# EAGLE schematic J007017_RGB_IR (EAGLE 7.7.0), part 1 of 2

## Sheet 1 of 6
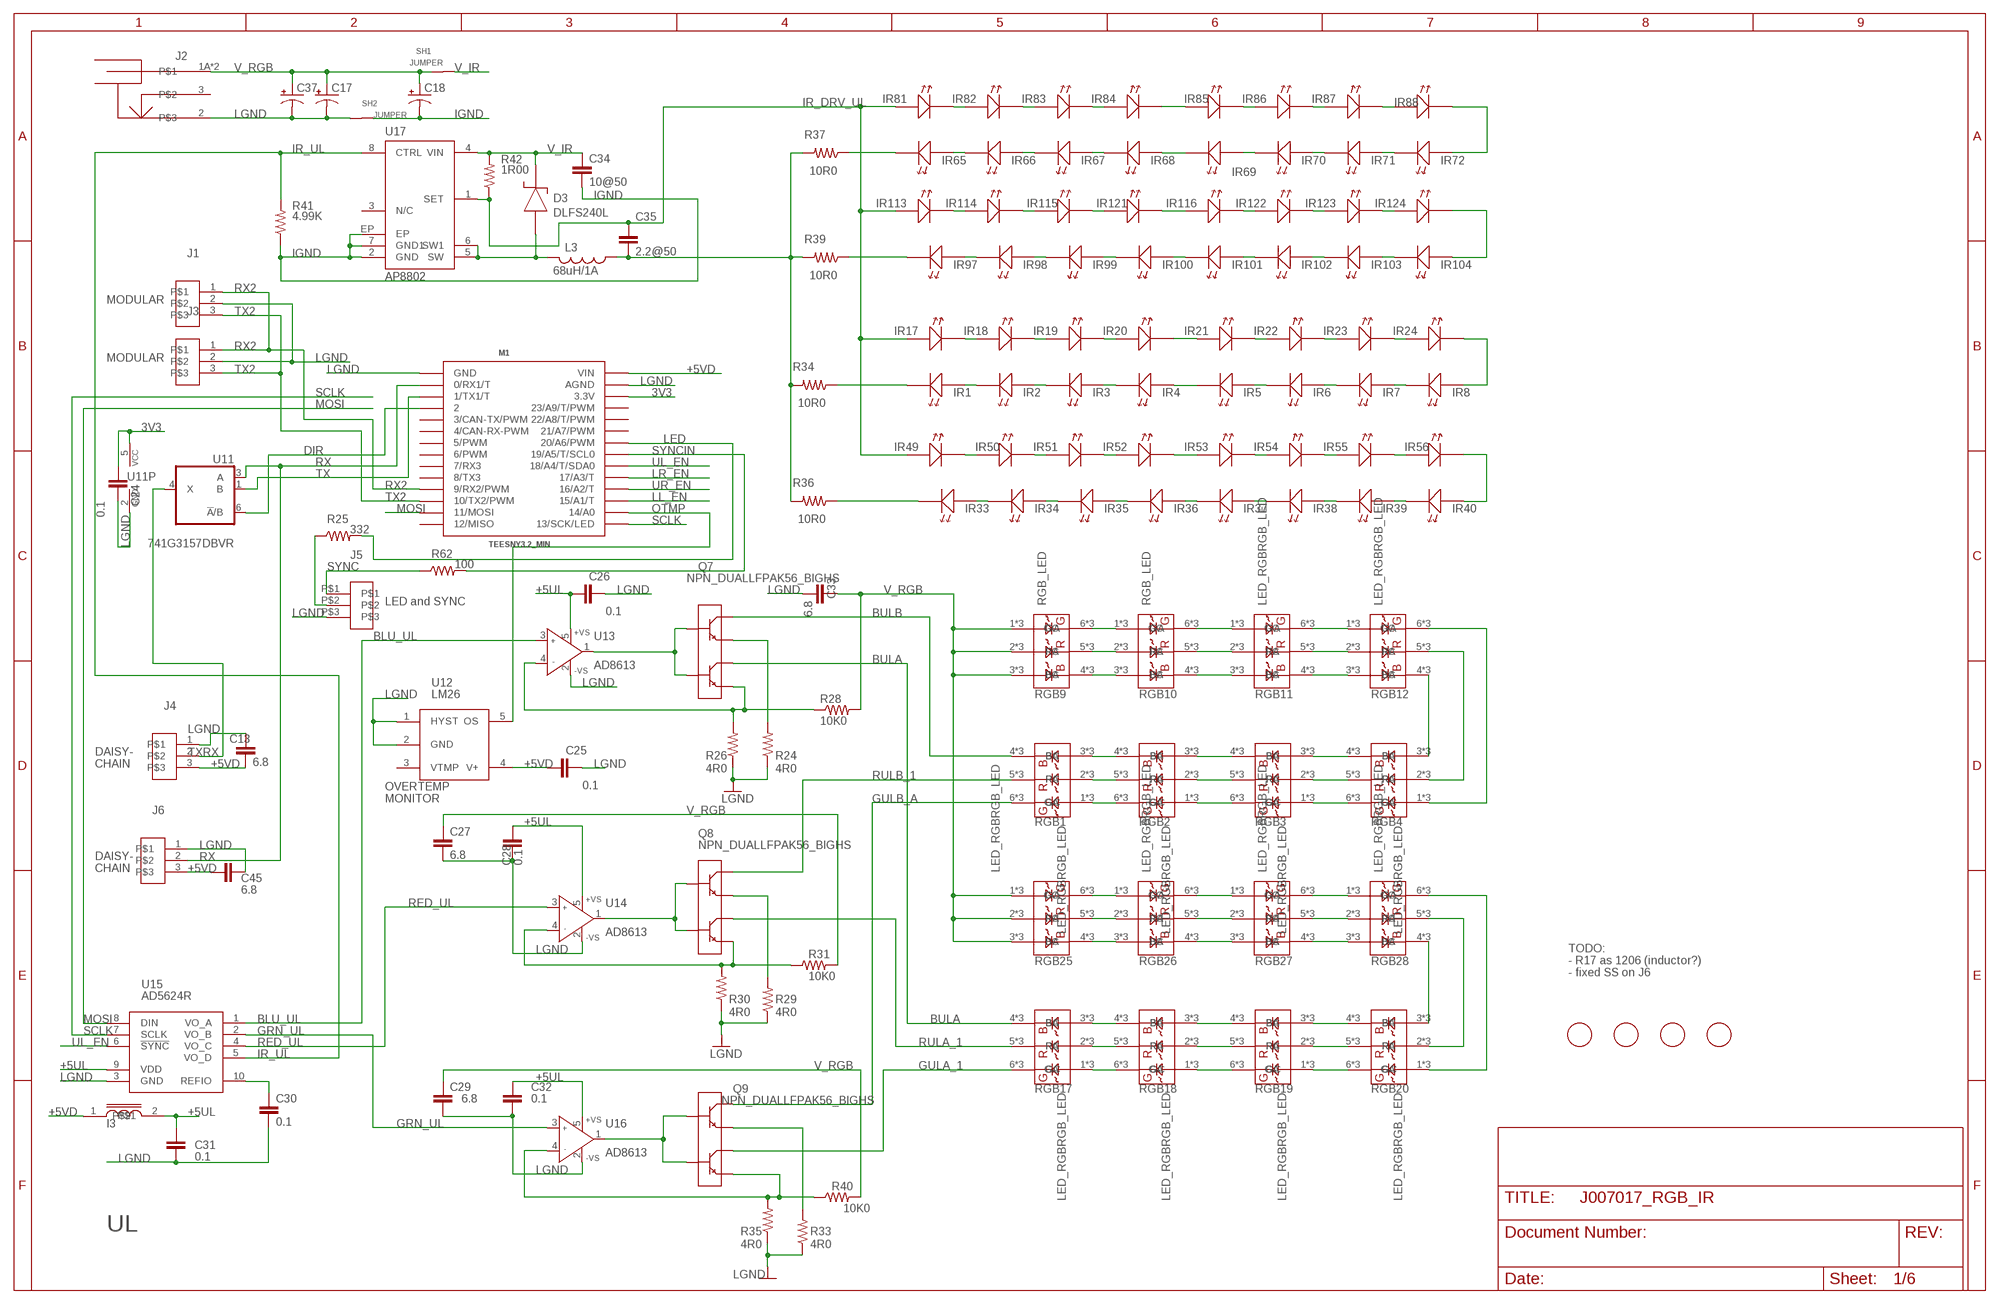
[diagram p0: schematic, sheet 1]

### Parts
$$U$1  FIDUCIAL  [FIDUCIAL_1MM]
$$U$2  FIDUCIAL  [FIDUCIAL_1MM]
$$U$3  FIDUCIAL  [FIDUCIAL_1MM]
C13  6.8  CAPS1210S  [1210S]
C17  CPOL-US153CLV-0810  [153CLV-0810]
C18  CPOL-US153CLV-0810  [153CLV-0810]
C24  0.1  CAPS0603S  [0603S]
C25  0.1  CAPS0603S  [0603S]
C26  0.1  CAPS0603S  [0603S]
C27  6.8  CAPS1210S  [1210S]
C28  0.1  CAPS0603S  [0603S]
C29  6.8  CAPS1210S  [1210S]
C30  0.1  CAPS0603S  [0603S]
C31  0.1  CAPS0603S  [0603S]
C32  0.1  CAPS0603S  [0603S]
C33  6.8  CAPS1210S  [1210S]
C34  10@50  CAPS1210S  [1210S]
C35  2.2@50  CAPS1206S  [1206S]
C37  CPOL-US153CLV-0810  [153CLV-0810]
C45  6.8  CAPS1210S  [1210S]
D3  DLFS240L  DIODE_SCHOTTKYPWRDI-123  [PWRDI-123]
I3  INDUCTOR0805S  [0805S]
IR1  LEDLED_SFH4050_A  [LED_SFH4045_HEAT_A]
IR2  LEDLED_SFH4050_HEAT  [LED_SFH4050_HEAT]
IR3  LEDLED_SFH4050_HEAT  [LED_SFH4050_HEAT]
IR4  LEDLED_SFH4050_HEAT  [LED_SFH4050_HEAT]
IR5  LEDLED_SFH4050_HEAT  [LED_SFH4050_HEAT]
IR6  LEDLED_SFH4050_HEAT  [LED_SFH4050_HEAT]
IR7  LEDLED_SFH4050_HEAT  [LED_SFH4050_HEAT]
IR8  LEDLED_SFH4050_HEAT  [LED_SFH4050_HEAT]
IR17  LEDLED_SFH4050_HEAT  [LED_SFH4050_HEAT]
IR18  LEDLED_SFH4050_HEAT  [LED_SFH4050_HEAT]
IR19  LEDLED_SFH4050_HEAT  [LED_SFH4050_HEAT]
IR20  LEDLED_SFH4050_HEAT  [LED_SFH4050_HEAT]
IR21  LEDLED_SFH4050_HEAT  [LED_SFH4050_HEAT]
IR22  LEDLED_SFH4050_HEAT  [LED_SFH4050_HEAT]
IR23  LEDLED_SFH4050_HEAT  [LED_SFH4050_HEAT]
IR24  LEDLED_SFH4050_HEAT  [LED_SFH4050_HEAT]
IR33  LEDLED_SFH4050_HEAT  [LED_SFH4050_HEAT]
IR34  LEDLED_SFH4050_HEAT  [LED_SFH4050_HEAT]
IR35  LEDLED_SFH4050_HEAT  [LED_SFH4050_HEAT]
IR36  LEDLED_SFH4050_HEAT  [LED_SFH4050_HEAT]
IR37  LEDLED_SFH4050_HEAT  [LED_SFH4050_HEAT]
IR38  LEDLED_SFH4050_HEAT  [LED_SFH4050_HEAT]
IR39  LEDLED_SFH4050_HEAT  [LED_SFH4050_HEAT]
IR40  LEDLED_SFH4050_HEAT  [LED_SFH4050_HEAT]
IR49  LEDLED_SFH4050_HEAT  [LED_SFH4050_HEAT]
IR50  LEDLED_SFH4050_HEAT  [LED_SFH4050_HEAT]
IR51  LEDLED_SFH4050_HEAT  [LED_SFH4050_HEAT]
IR52  LEDLED_SFH4050_HEAT  [LED_SFH4050_HEAT]
IR53  LEDLED_SFH4050_HEAT  [LED_SFH4050_HEAT]
IR54  LEDLED_SFH4050_HEAT  [LED_SFH4050_HEAT]
IR55  LEDLED_SFH4050_HEAT  [LED_SFH4050_HEAT]
IR56  LEDLED_SFH4050_HEAT  [LED_SFH4050_HEAT]
IR65  LEDLED_SFH4050_HEAT  [LED_SFH4050_HEAT]
IR66  LEDLED_SFH4050_HEAT  [LED_SFH4050_HEAT]
IR67  LEDLED_SFH4050_HEAT  [LED_SFH4050_HEAT]
IR68  LEDLED_SFH4050_HEAT  [LED_SFH4050_HEAT]
IR69  LEDLED_SFH4050_HEAT  [LED_SFH4050_HEAT]
IR70  LEDLED_SFH4050_HEAT  [LED_SFH4050_HEAT]
IR71  LEDLED_SFH4050_HEAT  [LED_SFH4050_HEAT]
IR72  LEDLED_SFH4050_HEAT  [LED_SFH4050_HEAT]
IR81  LEDLED_SFH4050_HEAT  [LED_SFH4050_HEAT]
IR82  LEDLED_SFH4050_HEAT  [LED_SFH4050_HEAT]
IR83  LEDLED_SFH4050_HEAT  [LED_SFH4050_HEAT]
IR84  LEDLED_SFH4050_HEAT  [LED_SFH4050_HEAT]
IR85  LEDLED_SFH4050_HEAT  [LED_SFH4050_HEAT]
IR86  LEDLED_SFH4050_HEAT  [LED_SFH4050_HEAT]
IR87  LEDLED_SFH4050_HEAT  [LED_SFH4050_HEAT]
IR88  LEDLED_SFH4050_HEAT  [LED_SFH4050_HEAT]
IR97  LEDLED_SFH4050_HEAT  [LED_SFH4050_HEAT]
IR98  LEDLED_SFH4050_HEAT  [LED_SFH4050_HEAT]
IR99  LEDLED_SFH4050_HEAT  [LED_SFH4050_HEAT]
IR100  LEDLED_SFH4050_HEAT  [LED_SFH4050_HEAT]
IR101  LEDLED_SFH4050_HEAT  [LED_SFH4050_HEAT]
IR102  LEDLED_SFH4050_HEAT  [LED_SFH4050_HEAT]
IR103  LEDLED_SFH4050_HEAT  [LED_SFH4050_HEAT]
IR104  LEDLED_SFH4050_HEAT  [LED_SFH4050_HEAT]
IR113  LEDLED_SFH4050_HEAT  [LED_SFH4050_HEAT]
IR114  LEDLED_SFH4050_HEAT  [LED_SFH4050_HEAT]
IR115  LEDLED_SFH4050_HEAT  [LED_SFH4050_HEAT]
IR116  LEDLED_SFH4050_HEAT  [LED_SFH4050_HEAT]
IR121  LEDLED_SFH4050_HEAT  [LED_SFH4050_HEAT]
IR122  LEDLED_SFH4050_HEAT  [LED_SFH4050_HEAT]
IR123  LEDLED_SFH4050_HEAT  [LED_SFH4050_HEAT]
IR124  LEDLED_SFH4050  [LED_SFH4050]
J1  CON3AMP-3-SM-RA-X  [AMP-3-SM-RA-X]
J2  POWER_JACK_SHUNTPJ-002  [PJ-002]
J3  CON3AMP_3_SM  [AMP_3_SM]
J4  CON3TE-3-SM-V  [TE_3_SM-V]
J5  CON3DF13-3-V-SM  [DF13_3_V_SM]
J6  CON3TE-3-SM-V  [TE_3_SM-V]
L3  68uH/1A  INDUCTOR_SMSRU8043  [SRU8043]
M1  TEESNY3.2_MIN  [TEENSY3.2_MIN_SM]
Q7  NPN_DUALLFPAK56_BIGHS  [LFPAK56_HS2]
Q8  NPN_DUALLFPAK56_BIGHS  [LFPAK56_HS2]
Q9  NPN_DUALLFPAK56_BIGHS  [LFPAK56_HS2]
R24  4R0  RESISTOR-POWER1812  [1812]
R25  332  RESISTOR_SM0805S  [0805S]
R26  4R0  RESISTOR-POWER1812  [1812]
R28  10K0  RESISTOR_SM1206S  [1206S]
R29  4R0  RESISTOR-POWER1812  [1812]
R30  4R0  RESISTOR-POWER1812  [1812]
R31  10K0  RESISTOR_SM1206S  [1206S]
R33  4R0  RESISTOR-POWER1812  [1812]
R34  10R0  RESISTOR_SM1206S  [1206S]
R35  4R0  RESISTOR-POWER1812  [1812]
R36  10R0  RESISTOR_SM1206S  [1206S]
R37  10R0  RESISTOR_SM1206S  [1206S]
R39  10R0  RESISTOR_SM1206S  [1206S]
R40  10K0  RESISTOR_SM1206S  [1206S]
R41  4.99K  RESISTOR_SM0805S  [0805S]
R42  1R00  RESISTOR_SM1206S  [1206S]
R62  100  RESISTOR_SM0805S  [0805S]
RGB1  LED_RGBRGB_LED  [OVSPRGB_HS_FIXED]
RGB2  LED_RGBRGB_LED  [OVSPRGB_HS_FIXED]
RGB3  LED_RGBRGB_LED  [OVSPRGB_HS_FIXED]
RGB4  LED_RGBRGB_LED  [OVSPRGB_HS_FIXED]
RGB9  RGB_LED  LED_RGBRGB_LED  [OVSPRGB_HS_FIXED]
RGB10  RGB_LED  LED_RGBRGB_LED  [OVSPRGB_HS_FIXED]
RGB11  LED_RGBRGB_LED  [OVSPRGB_HS_FIXED]
RGB12  LED_RGBRGB_LED  [OVSPRGB_HS_FIXED]
RGB17  LED_RGBRGB_LED  [OVSPRGB_HS_FIXED]
RGB18  LED_RGBRGB_LED  [OVSPRGB_HS_FIXED]
RGB19  LED_RGBRGB_LED  [OVSPRGB_HS_FIXED]
RGB20  LED_RGBRGB_LED  [OVSPRGB_HS_FIXED]
RGB25  LED_RGBRGB_LED  [OVSPRGB_HS_FIXED]
RGB26  LED_RGBRGB_LED  [OVSPRGB_HS_FIXED]
RGB27  LED_RGBRGB_LED  [OVSPRGB_HS_FIXED]
RGB28  LED_RGBRGB_LED  [OVSPRGB_HS_FIXED]
SH1  JUMPER  [JUMPER]
SH2  JUMPER  [JUMPER]
U11  741G3157DBVR  [DBV_R-PDSO-G6]
U12  LM26  [SOT23-5]
U13  AD8613  AD8065RT  [SOT23-5]
U14  AD8613  AD8065RT  [SOT23-5]
U15  AD5624R  AD56X4R  [MSOP10]
U16  AD8613  AD8065RT  [SOT23-5]
U17  AP8802  [SOIC8-EP]
U$2  FIDUCIAL  [FIDUCIAL_1MM]

### Nets
3V3: C24.1 M1.26(3.3V) U11.5(VCC)
+5UL: C26.1 C28.1 C31.1 C32.1 I3.2 U13.5(+VS) U14.5(+VS) U15.9(VDD) U16.5(+VS)
+5VD: C13.2 C25.1 C45.1 I3.1 J4.3 J6.3 M1.28(VIN) U12.4(V+) ; also sheet 3,4,6
BLU_UL: U13.3(IN+) U15.1(VO_A)
BULA: Q7.5(C2) Q7.5A1(C2) Q7.5A(C2) Q7.5B(C2) Q7.5C1(C2) Q7.5C2(C2) Q7.5C(C2) Q7.6(C2) Q7.56(C2) Q7.56A(C2) Q7.56B(C2) RGB17.4(BC) RGB17.4A(BC) RGB17.4B(BC)
BULB: Q7.7(C1) Q7.8(C1) Q7.8A(C1) Q7.8B(C1) Q7.8C1(C1) Q7.8C2(C1) Q7.8C3(C1) Q7.8C(C1) Q7.78(C1) Q7.78A(C1) Q7.78B(C1) RGB1.4(BC) RGB1.4A(BC) RGB1.4B(BC)
DIR: M1.4 U11.6(!A!/B)
GRN_UL: U15.2(VO_B) U16.3(IN+)
GULA_1: Q9.5(C2) Q9.5A1(C2) Q9.5A(C2) Q9.5B(C2) Q9.5C1(C2) Q9.5C2(C2) Q9.5C(C2) Q9.6(C2) Q9.56(C2) Q9.56A(C2) Q9.56B(C2) RGB17.6(GC) RGB17.6A(GC) RGB17.6B(GC)
GULB_A: Q9.7(C1) Q9.8(C1) Q9.8A(C1) Q9.8B(C1) Q9.8C1(C1) Q9.8C2(C1) Q9.8C3(C1) Q9.8C(C1) Q9.78(C1) Q9.78A(C1) Q9.78B(C1) RGB1.6(GC) RGB1.6A(GC) RGB1.6B(GC)
IGND: C18.- C34.2 R41.1 SH2.2 U17.2(GND) U17.7(GND1) U17.EP ; also sheet 3,4,6
IR_DRV_UL: C35.1 IR17.A IR17.A1(A) IR49.A IR49.A1(A) IR81.A IR81.A1(A) IR113.A IR113.A1(A) R42.1 U17.1(SET)
IR_RET_UL: C35.2 L3.1 R34.2 R36.2 R37.2 R39.2
IR_UL: R41.2 U15.5(VO_D) U17.8(CTRL)
LED: M1.22(20/A6/PWM) R25.2
LGND: C13.1 C17.- C24.2 C25.2 C26.2 C27.2 C28.2 C29.2 C30.2 C31.2 C32.2 C33.2 C37.- C45.2 J1.2 J2.2 J3.2 J4.1 J5.P$3 J6.1 M1.1(GND) M1.27(AGND) R24.1 R26.1 R29.1 R30.1 R33.1 R35.1 SH2.1 U11.2(GND) U12.1(HYST) U12.2(GND) U13.2(-VS) U14.2(-VS) U15.3(GND) U16.2(-VS) ; also sheet 3,4,6
LL_EN: M1.17(15/A1/T) ; also sheet 3
LR_EN: M1.19(17/A3/T) ; also sheet 6
MOSI: M1.13(11/MOSI) U15.8(DIN) ; also sheet 3,4,6
N$1: IR7.A IR7.A1(A) IR8.C1(K) IR8.C(K)
N$2: IR6.A IR6.A1(A) IR7.C1(K) IR7.C(K)
N$3: IR71.A IR71.A1(A) IR72.C1(K) IR72.C(K)
N$4: IR70.A IR70.A1(A) IR71.C1(K) IR71.C(K)
N$5: IR69.A IR69.A1(A) IR70.C1(K) IR70.C(K)
N$6: IR67.A IR67.A1(A) IR68.C1(K) IR68.C(K)
N$7: IR66.A IR66.A1(A) IR67.C1(K) IR67.C(K)
N$8: IR65.A IR65.A1(A) IR66.C1(K) IR66.C(K)
N$9: IR5.A IR5.A1(A) IR6.C1(K) IR6.C(K)
N$10: IR3.A IR3.A1(A) IR4.C1(K) IR4.C(K)
N$11: IR2.A IR2.A1(A) IR3.C1(K) IR3.C(K)
N$12: IR1.A IR1.A1(A) IR2.C1(K) IR2.C(K)
N$13: IR17.C1(K) IR17.C(K) IR18.A IR18.A1(A)
N$14: IR81.C1(K) IR81.C(K) IR82.A IR82.A1(A)
N$15: IR18.C1(K) IR18.C(K) IR19.A IR19.A1(A)
N$16: IR82.C1(K) IR82.C(K) IR83.A IR83.A1(A)
N$17: IR83.C1(K) IR83.C(K) IR84.A IR84.A1(A)
N$18: IR68.A IR68.A1(A) IR69.C1(K) IR69.C(K)
N$19: IR103.A IR103.A1(A) IR104.C1(K) IR104.C(K)
N$20: IR102.A IR102.A1(A) IR103.C1(K) IR103.C(K)
N$21: IR101.A IR101.A1(A) IR102.C1(K) IR102.C(K)
N$22: IR100.A IR100.A1(A) IR101.C1(K) IR101.C(K)
N$23: IR99.A IR99.A1(A) IR100.C1(K) IR100.C(K)
N$24: IR19.C1(K) IR19.C(K) IR20.A IR20.A1(A)
N$25: IR4.A IR4.A1(A) IR5.C1(K) IR5.C(K)
N$26: IR39.A IR39.A1(A) IR40.C1(K) IR40.C(K)
N$27: IR38.A IR38.A1(A) IR39.C1(K) IR39.C(K)
N$28: IR37.A IR37.A1(A) IR38.C1(K) IR38.C(K)
N$29: IR98.A IR98.A1(A) IR99.C1(K) IR99.C(K)
N$30: IR36.A IR36.A1(A) IR37.C1(K) IR37.C(K)
N$31: IR35.A IR35.A1(A) IR36.C1(K) IR36.C(K)
N$32: IR97.A IR97.A1(A) IR98.C1(K) IR98.C(K)
N$33: IR85.C1(K) IR85.C(K) IR86.A IR86.A1(A)
N$34: IR86.C1(K) IR86.C(K) IR87.A IR87.A1(A)
N$35: IR34.A IR34.A1(A) IR35.C1(K) IR35.C(K)
N$36: IR87.C1(K) IR87.C(K) IR88.A IR88.A1(A)
N$37: IR33.A IR33.A1(A) IR34.C1(K) IR34.C(K)
N$38: IR21.C1(K) IR21.C(K) IR22.A IR22.A1(A)
N$39: IR22.C1(K) IR22.C(K) IR23.A IR23.A1(A)
N$40: IR23.C1(K) IR23.C(K) IR24.A IR24.A1(A)
N$41: IR49.C1(K) IR49.C(K) IR50.A IR50.A1(A)
N$42: IR50.C1(K) IR50.C(K) IR51.A IR51.A1(A)
N$43: IR51.C1(K) IR51.C(K) IR52.A IR52.A1(A)
N$44: IR53.C1(K) IR53.C(K) IR54.A IR54.A1(A)
N$45: IR54.C1(K) IR54.C(K) IR55.A IR55.A1(A)
N$46: IR55.C1(K) IR55.C(K) IR56.A IR56.A1(A)
N$47: IR113.C1(K) IR113.C(K) IR114.A IR114.A1(A)
N$48: IR20.C1(K) IR20.C(K) IR21.A IR21.A1(A)
N$49: IR114.C1(K) IR114.C(K) IR115.A IR115.A1(A)
N$50: IR8.A IR8.A1(A) IR24.C1(K) IR24.C(K)
N$51: IR52.C1(K) IR52.C(K) IR53.A IR53.A1(A)
N$52: IR115.C1(K) IR115.C(K) IR121.A IR121.A1(A)
N$53: IR1.C(K) R34.1
N$54: IR40.A IR40.A1(A) IR56.C1(K) IR56.C(K)
N$55: IR33.C1(K) IR33.C(K) R36.1
N$56: RGB9.6(GC) RGB9.6A(GC) RGB9.6B(GC) RGB10.1(GA) RGB10.1A(GA) RGB10.1B(GA)
N$57: RGB9.5(RC) RGB9.5A(RC) RGB9.5B(RC) RGB10.2(RA) RGB10.2A(RA) RGB10.2B(RA)
N$58: IR65.C1(K) IR65.C(K) R37.1
N$60: RGB9.4(BC) RGB9.4A(BC) RGB9.4B(BC) RGB10.3(BA) RGB10.3A(BA) RGB10.3B(BA)
N$61: IR116.C1(K) IR116.C(K) IR122.A IR122.A1(A)
N$63: RGB10.6(GC) RGB10.6A(GC) RGB10.6B(GC) RGB11.1(GA) RGB11.1A(GA) RGB11.1B(GA)
N$64: IR122.C1(K) IR122.C(K) IR123.A IR123.A1(A)
N$65: IR123.C1(K) IR123.C(K) IR124.A
N$66: Q8.3(E2) R30.2 R31.1 U14.4(IN-)
N$67: D3.A L3.2 U17.5(SW) U17.6(SW1)
N$68: IR84.C1(K) IR84.C(K) IR85.A IR85.A1(A)
N$69: RGB10.5(RC) RGB10.5A(RC) RGB10.5B(RC) RGB11.2(RA) RGB11.2A(RA) RGB11.2B(RA)
N$70: IR72.A IR72.A1(A) IR88.C1(K) IR88.C(K)
N$71: C30.1 U15.10(REFIO)
N$72: IR116.A IR116.A1(A) IR121.C1(K) IR121.C(K)
N$73: RGB10.4(BC) RGB10.4A(BC) RGB10.4B(BC) RGB11.3(BA) RGB11.3A(BA) RGB11.3B(BA)
N$74: RGB11.6(GC) RGB11.6A(GC) RGB11.6B(GC) RGB12.1(GA) RGB12.1A(GA) RGB12.1B(GA)
N$75: IR104.A IR104.A1(A) IR124.C(K)
N$77: RGB11.5(RC) RGB11.5A(RC) RGB11.5B(RC) RGB12.2(RA) RGB12.2A(RA) RGB12.2B(RA)
N$78: IR97.C1(K) IR97.C(K) R39.1
N$79: Q9.3(E2) R35.2 R40.1 U16.4(IN-)
N$80: RGB11.4(BC) RGB11.4A(BC) RGB11.4B(BC) RGB12.3(BA) RGB12.3A(BA) RGB12.3B(BA)
N$81: RGB4.1(GA) RGB4.1A(GA) RGB4.1B(GA) RGB12.6(GC) RGB12.6A(GC) RGB12.6B(GC)
N$82: Q8.1(E1) R29.2
N$83: RGB4.2(RA) RGB4.2A(RA) RGB4.2B(RA) RGB12.5(RC) RGB12.5A(RC) RGB12.5B(RC)
N$84: Q8.2(B1) Q8.4(B2) U14.1(OUT)
N$85: RGB4.3(BA) RGB4.3A(BA) RGB4.3B(BA) RGB12.4(BC) RGB12.4A(BC) RGB12.4B(BC)
N$86: RGB3.1(GA) RGB3.1A(GA) RGB3.1B(GA) RGB4.6(GC) RGB4.6A(GC) RGB4.6B(GC)
N$87: RGB3.2(RA) RGB3.2A(RA) RGB3.2B(RA) RGB4.5(RC) RGB4.5A(RC) RGB4.5B(RC)
N$88: RGB3.3(BA) RGB3.3A(BA) RGB3.3B(BA) RGB4.4(BC) RGB4.4A(BC) RGB4.4B(BC)
N$89: RGB2.1(GA) RGB2.1A(GA) RGB2.1B(GA) RGB3.6(GC) RGB3.6A(GC) RGB3.6B(GC)
N$91: RGB2.2(RA) RGB2.2A(RA) RGB2.2B(RA) RGB3.5(RC) RGB3.5A(RC) RGB3.5B(RC)
N$92: RGB2.3(BA) RGB2.3A(BA) RGB2.3B(BA) RGB3.4(BC) RGB3.4A(BC) RGB3.4B(BC)
N$93: RGB1.1(GA) RGB1.1A(GA) RGB1.1B(GA) RGB2.6(GC) RGB2.6A(GC) RGB2.6B(GC)
N$94: RGB1.2(RA) RGB1.2A(RA) RGB1.2B(RA) RGB2.5(RC) RGB2.5A(RC) RGB2.5B(RC)
N$95: RGB1.3(BA) RGB1.3A(BA) RGB1.3B(BA) RGB2.4(BC) RGB2.4A(BC) RGB2.4B(BC)
N$97: Q9.2(B1) Q9.4(B2) U16.1(OUT)
N$99: RGB25.6(GC) RGB25.6A(GC) RGB25.6B(GC) RGB26.1(GA) RGB26.1A(GA) RGB26.1B(GA)
N$100: RGB25.5(RC) RGB25.5A(RC) RGB25.5B(RC) RGB26.2(RA) RGB26.2A(RA) RGB26.2B(RA)
N$101: RGB25.4(BC) RGB25.4A(BC) RGB25.4B(BC) RGB26.3(BA) RGB26.3A(BA) RGB26.3B(BA)
N$102: RGB26.6(GC) RGB26.6A(GC) RGB26.6B(GC) RGB27.1(GA) RGB27.1A(GA) RGB27.1B(GA)
N$103: RGB26.5(RC) RGB26.5A(RC) RGB26.5B(RC) RGB27.2(RA) RGB27.2A(RA) RGB27.2B(RA)
N$104: RGB26.4(BC) RGB26.4A(BC) RGB26.4B(BC) RGB27.3(BA) RGB27.3A(BA) RGB27.3B(BA)
N$105: RGB27.6(GC) RGB27.6A(GC) RGB27.6B(GC) RGB28.1(GA) RGB28.1A(GA) RGB28.1B(GA)
N$106: RGB27.5(RC) RGB27.5A(RC) RGB27.5B(RC) RGB28.2(RA) RGB28.2A(RA) RGB28.2B(RA)
N$107: RGB27.4(BC) RGB27.4A(BC) RGB27.4B(BC) RGB28.3(BA) RGB28.3A(BA) RGB28.3B(BA)
N$108: RGB20.1(GA) RGB20.1A(GA) RGB20.1B(GA) RGB28.6(GC) RGB28.6A(GC) RGB28.6B(GC)
N$109: RGB20.2(RA) RGB20.2A(RA) RGB20.2B(RA) RGB28.5(RC) RGB28.5A(RC) RGB28.5B(RC)
N$110: RGB20.3(BA) RGB20.3A(BA) RGB20.3B(BA) RGB28.4(BC) RGB28.4A(BC) RGB28.4B(BC)
N$111: RGB19.1(GA) RGB19.1A(GA) RGB19.1B(GA) RGB20.6(GC) RGB20.6A(GC) RGB20.6B(GC)
N$112: RGB19.2(RA) RGB19.2A(RA) RGB19.2B(RA) RGB20.5(RC) RGB20.5A(RC) RGB20.5B(RC)
N$113: RGB19.3(BA) RGB19.3A(BA) RGB19.3B(BA) RGB20.4(BC) RGB20.4A(BC) RGB20.4B(BC)
N$114: RGB18.1(GA) RGB18.1A(GA) RGB18.1B(GA) RGB19.6(GC) RGB19.6A(GC) RGB19.6B(GC)
N$115: RGB18.2(RA) RGB18.2A(RA) RGB18.2B(RA) RGB19.5(RC) RGB19.5A(RC) RGB19.5B(RC)
N$116: RGB18.3(BA) RGB18.3A(BA) RGB18.3B(BA) RGB19.4(BC) RGB19.4A(BC) RGB19.4B(BC)
N$117: RGB17.1(GA) RGB17.1A(GA) RGB17.1B(GA) RGB18.6(GC) RGB18.6A(GC) RGB18.6B(GC)
N$118: RGB17.2(RA) RGB17.2A(RA) RGB17.2B(RA) RGB18.5(RC) RGB18.5A(RC) RGB18.5B(RC)
N$119: RGB17.3(BA) RGB17.3A(BA) RGB17.3B(BA) RGB18.4(BC) RGB18.4A(BC) RGB18.4B(BC)
N$120: Q7.2(B1) Q7.4(B2) U13.1(OUT)
N$123: Q7.1(E1) R24.2
N$125: Q9.1(E1) R33.2
N$208: Q7.3(E2) R26.2 R28.1 U13.4(IN-)
N$376: J5.P$2 R25.1
OTMP: M1.16(14/A0) U12.5(OS)
RED_UL: U14.3(IN+) U15.4(VO_C)
RULA_1: Q8.5(C2) Q8.5A1(C2) Q8.5A(C2) Q8.5B(C2) Q8.5C1(C2) Q8.5C2(C2) Q8.5C(C2) Q8.6(C2) Q8.56(C2) Q8.56A(C2) Q8.56B(C2) RGB17.5(RC) RGB17.5A(RC) RGB17.5B(RC)
RULB_1: Q8.7(C1) Q8.8(C1) Q8.8A(C1) Q8.8B(C1) Q8.8C1(C1) Q8.8C2(C1) Q8.8C3(C1) Q8.8C(C1) Q8.78(C1) Q8.78A(C1) Q8.78B(C1) RGB1.5(RC) RGB1.5A(RC) RGB1.5B(RC)
RX: J6.2 M1.2(0/RX1/T) U11.3(A)
RX2: J1.1 J3.1 M1.11(9/RX2/PWM)
SCLK: M1.15(13/SCK/LED) U15.7(SCLK) ; also sheet 3,4,6
SYNC: J5.P$1 R62.1
SYNCIN: M1.21(19/A5/T/SCL0) R62.2
TX: M1.3(1/TX1/T) U11.1(B)
TX2: J1.3 J3.3 M1.12(10/TX2/PWM)
TXRX: J4.2 U11.4(X)
UL_EN: M1.20(18/A4/T/SDA0) U15.6(!SYNC)
UR_EN: M1.18(16/A2/T) ; also sheet 4
V_IR: C34.1 D3.K R42.2 SH1.1 U17.4(VIN) ; also sheet 3,4,6
V_RGB: C17.+ C18.+ C27.1 C29.1 C33.1 C37.+ J2.1A J2.1B R28.2 R31.2 R40.2 RGB9.1(GA) RGB9.1A(GA) RGB9.1B(GA) RGB9.2(RA) RGB9.2A(RA) RGB9.2B(RA) RGB9.3(BA) RGB9.3A(BA) RGB9.3B(BA) RGB25.1(GA) RGB25.1A(GA) RGB25.1B(GA) RGB25.2(RA) RGB25.2A(RA) RGB25.2B(RA) RGB25.3(BA) RGB25.3A(BA) RGB25.3B(BA) SH1.2 ; also sheet 3,4,6
Unconnected: J2.3 M1.5(3/CAN-TX/PWM) M1.6(4/CAN-RX-PWM) M1.7(5/PWM) M1.8(6/PWM) M1.9(7/RX3) M1.10(8/TX3) M1.14(12/MISO) M1.23(21/A7/PWM) M1.24(22/A8/T/PWM) M1.25(23/A9/T/PWM) U12.3(VTMP) U17.3(N/C)

### Notes on the sheet
- MODULAR
- MODULAR
- LED and SYNC
- DAISY-
  CHAIN
- OVERTEMP
  MONITOR
- DAISY-
  CHAIN
- TODO:
  - R17 as 1206 (inductor?)
  - fixed SS on J6
- UL

## Sheet 2 of 6

## Sheet 3 of 6
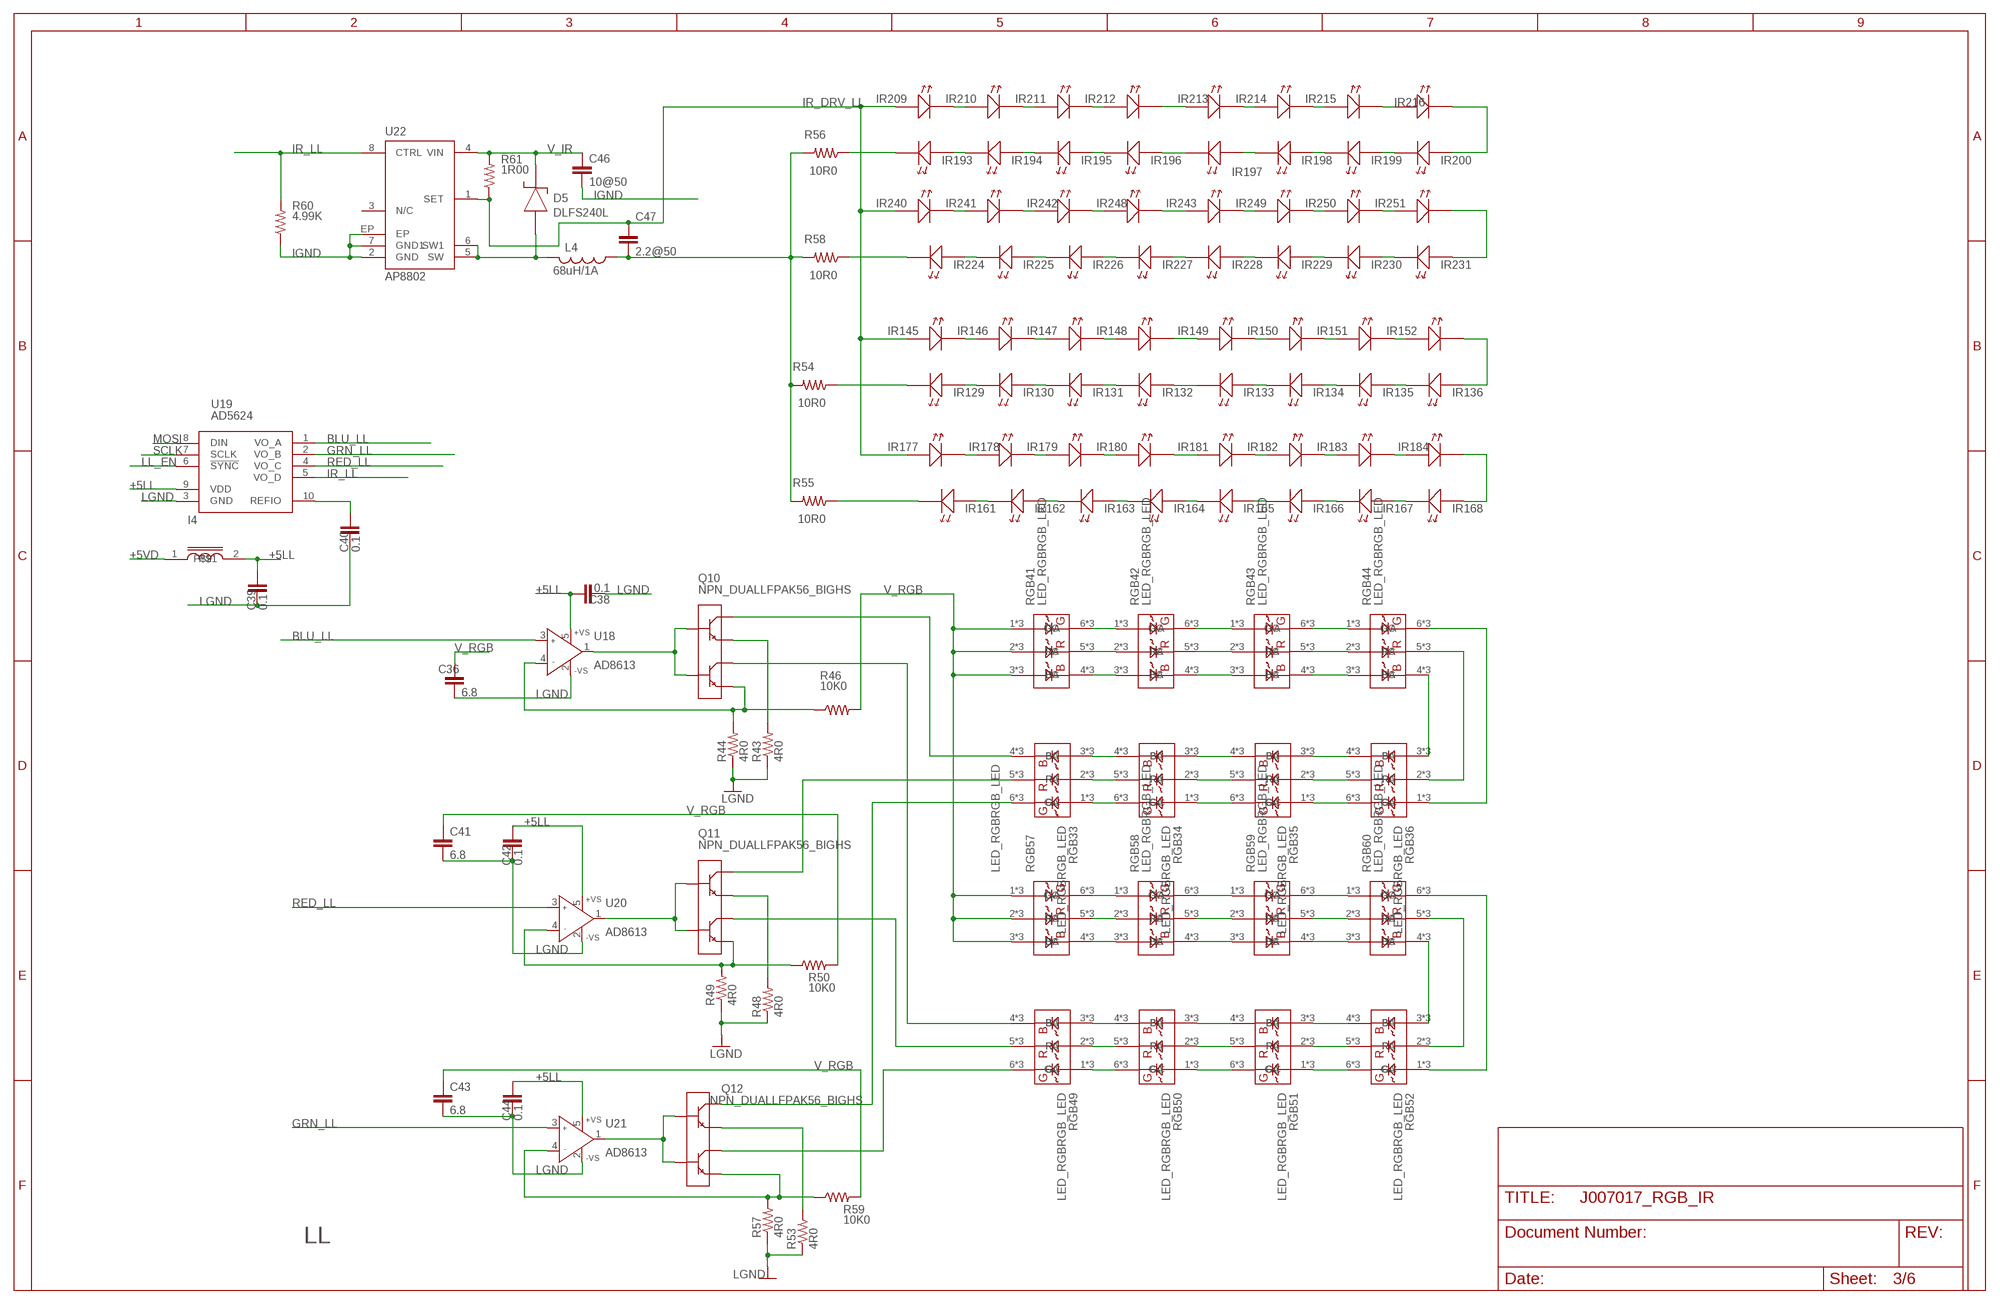
[diagram p1: schematic, sheet 3]

### Parts
C36  6.8  CAPS1210S  [1210S]
C38  0.1  CAPS0603S  [0603S]
C39  0.1  CAPS0603S  [0603S]
C40  0.1  CAPS0603S  [0603S]
C41  6.8  CAPS1210S  [1210S]
C42  0.1  CAPS0603S  [0603S]
C43  6.8  CAPS1210S  [1210S]
C44  0.1  CAPS0603S  [0603S]
C46  10@50  CAPS1210S  [1210S]
C47  2.2@50  CAPS1206S  [1206S]
D5  DLFS240L  DIODE_SCHOTTKYPWRDI-123  [PWRDI-123]
I4  INDUCTOR0805S  [0805S]
IR129  LEDLED_SFH4050_A  [LED_SFH4045_HEAT_A]
IR130  LEDLED_SFH4050_HEAT  [LED_SFH4050_HEAT]
IR131  LEDLED_SFH4050_HEAT  [LED_SFH4050_HEAT]
IR132  LEDLED_SFH4050_HEAT  [LED_SFH4050_HEAT]
IR133  LEDLED_SFH4050_HEAT  [LED_SFH4050_HEAT]
IR134  LEDLED_SFH4050_HEAT  [LED_SFH4050_HEAT]
IR135  LEDLED_SFH4050_HEAT  [LED_SFH4050_HEAT]
IR136  LEDLED_SFH4050  [LED_SFH4050]
IR145  LEDLED_SFH4050_HEAT  [LED_SFH4050_HEAT]
IR146  LEDLED_SFH4050_HEAT  [LED_SFH4050_HEAT]
IR147  LEDLED_SFH4050_HEAT  [LED_SFH4050_HEAT]
IR148  LEDLED_SFH4050_HEAT  [LED_SFH4050_HEAT]
IR149  LEDLED_SFH4050_HEAT  [LED_SFH4050_HEAT]
IR150  LEDLED_SFH4050_HEAT  [LED_SFH4050_HEAT]
IR151  LEDLED_SFH4050_HEAT  [LED_SFH4050_HEAT]
IR152  LEDLED_SFH4050_HEAT  [LED_SFH4050_HEAT]
IR161  LEDLED_SFH4050_HEAT  [LED_SFH4050_HEAT]
IR162  LEDLED_SFH4050_HEAT  [LED_SFH4050_HEAT]
IR163  LEDLED_SFH4050_HEAT  [LED_SFH4050_HEAT]
IR164  LEDLED_SFH4050_HEAT  [LED_SFH4050_HEAT]
IR165  LEDLED_SFH4050_HEAT  [LED_SFH4050_HEAT]
IR166  LEDLED_SFH4050_HEAT  [LED_SFH4050_HEAT]
IR167  LEDLED_SFH4050_HEAT  [LED_SFH4050_HEAT]
IR168  LEDLED_SFH4050_HEAT  [LED_SFH4050_HEAT]
IR177  LEDLED_SFH4050_HEAT  [LED_SFH4050_HEAT]
IR178  LEDLED_SFH4050_HEAT  [LED_SFH4050_HEAT]
IR179  LEDLED_SFH4050_HEAT  [LED_SFH4050_HEAT]
IR180  LEDLED_SFH4050_HEAT  [LED_SFH4050_HEAT]
IR181  LEDLED_SFH4050_HEAT  [LED_SFH4050_HEAT]
IR182  LEDLED_SFH4050_HEAT  [LED_SFH4050_HEAT]
IR183  LEDLED_SFH4050_HEAT  [LED_SFH4050_HEAT]
IR184  LEDLED_SFH4050_HEAT  [LED_SFH4050_HEAT]
IR193  LEDLED_SFH4050_HEAT  [LED_SFH4050_HEAT]
IR194  LEDLED_SFH4050_HEAT  [LED_SFH4050_HEAT]
IR195  LEDLED_SFH4050_HEAT  [LED_SFH4050_HEAT]
IR196  LEDLED_SFH4050_HEAT  [LED_SFH4050_HEAT]
IR197  LEDLED_SFH4050_HEAT  [LED_SFH4050_HEAT]
IR198  LEDLED_SFH4050_HEAT  [LED_SFH4050_HEAT]
IR199  LEDLED_SFH4050_HEAT  [LED_SFH4050_HEAT]
IR200  LEDLED_SFH4050_HEAT  [LED_SFH4050_HEAT]
IR209  LEDLED_SFH4050_HEAT  [LED_SFH4050_HEAT]
IR210  LEDLED_SFH4050_HEAT  [LED_SFH4050_HEAT]
IR211  LEDLED_SFH4050_HEAT  [LED_SFH4050_HEAT]
IR212  LEDLED_SFH4050_HEAT  [LED_SFH4050_HEAT]
IR213  LEDLED_SFH4050_HEAT  [LED_SFH4050_HEAT]
IR214  LEDLED_SFH4050_HEAT  [LED_SFH4050_HEAT]
IR215  LEDLED_SFH4050_HEAT  [LED_SFH4050_HEAT]
IR216  LEDLED_SFH4050_HEAT  [LED_SFH4050_HEAT]
IR224  LEDLED_SFH4050_HEAT  [LED_SFH4050_HEAT]
IR225  LEDLED_SFH4050_HEAT  [LED_SFH4050_HEAT]
IR226  LEDLED_SFH4050_HEAT  [LED_SFH4050_HEAT]
IR227  LEDLED_SFH4050_HEAT  [LED_SFH4050_HEAT]
IR228  LEDLED_SFH4050_HEAT  [LED_SFH4050_HEAT]
IR229  LEDLED_SFH4050_HEAT  [LED_SFH4050_HEAT]
IR230  LEDLED_SFH4050_HEAT  [LED_SFH4050_HEAT]
IR231  LEDLED_SFH4050_HEAT  [LED_SFH4050_HEAT]
IR240  LEDLED_SFH4050_HEAT  [LED_SFH4050_HEAT]
IR241  LEDLED_SFH4050_HEAT  [LED_SFH4050_HEAT]
IR242  LEDLED_SFH4050_HEAT  [LED_SFH4050_HEAT]
IR243  LEDLED_SFH4050_HEAT  [LED_SFH4050_HEAT]
IR248  LEDLED_SFH4050_HEAT  [LED_SFH4050_HEAT]
IR249  LEDLED_SFH4050_HEAT  [LED_SFH4050_HEAT]
IR250  LEDLED_SFH4050_HEAT  [LED_SFH4050_HEAT]
IR251  LEDLED_SFH4050  [LED_SFH4050]
L4  68uH/1A  INDUCTOR_SMSRU8043  [SRU8043]
Q10  NPN_DUALLFPAK56_BIGHS  [LFPAK56_HS2]
Q11  NPN_DUALLFPAK56_BIGHS  [LFPAK56_HS2]
Q12  NPN_DUALLFPAK56_BIGHS  [LFPAK56_HS2]
R43  4R0  RESISTOR-POWER1812  [1812]
R44  4R0  RESISTOR-POWER1812  [1812]
R46  10K0  RESISTOR_SM1206S  [1206S]
R48  4R0  RESISTOR-POWER1812  [1812]
R49  4R0  RESISTOR-POWER1812  [1812]
R50  10K0  RESISTOR_SM1206S  [1206S]
R53  4R0  RESISTOR-POWER1812  [1812]
R54  10R0  RESISTOR_SM1206S  [1206S]
R55  10R0  RESISTOR_SM1206S  [1206S]
R56  10R0  RESISTOR_SM1206S  [1206S]
R57  4R0  RESISTOR-POWER1812  [1812]
R58  10R0  RESISTOR_SM1206S  [1206S]
R59  10K0  RESISTOR_SM1206S  [1206S]
R60  4.99K  RESISTOR_SM0805S  [0805S]
R61  1R00  RESISTOR_SM1206S  [1206S]
RGB33  LED_RGBRGB_LED  [OVSPRGB_HS_FIXED]
RGB34  LED_RGBRGB_LED  [OVSPRGB_HS_FIXED]
RGB35  LED_RGBRGB_LED  [OVSPRGB_HS_FIXED]
RGB36  LED_RGBRGB_LED  [OVSPRGB_HS_FIXED]
RGB41  LED_RGBRGB_LED  [OVSPRGB_HS_FIXED]
RGB42  LED_RGBRGB_LED  [OVSPRGB_HS_FIXED]
RGB43  LED_RGBRGB_LED  [OVSPRGB_HS_FIXED]
RGB44  LED_RGBRGB_LED  [OVSPRGB_HS_FIXED]
RGB49  LED_RGBRGB_LED  [OVSPRGB_HS_FIXED]
RGB50  LED_RGBRGB_LED  [OVSPRGB_HS_FIXED]
RGB51  LED_RGBRGB_LED  [OVSPRGB_HS_FIXED]
RGB52  LED_RGBRGB_LED  [OVSPRGB_HS_FIXED]
RGB57  LED_RGBRGB_LED  [OVSPRGB_HS_FIXED]
RGB58  LED_RGBRGB_LED  [OVSPRGB_HS_FIXED]
RGB59  LED_RGBRGB_LED  [OVSPRGB_HS_FIXED]
RGB60  LED_RGBRGB_LED  [OVSPRGB_HS_FIXED]
U18  AD8613  AD8065RT  [SOT23-5]
U19  AD5624  AD56X4R  [MSOP10]
U20  AD8613  AD8065RT  [SOT23-5]
U21  AD8613  AD8065RT  [SOT23-5]
U22  AP8802  [SOIC8-EP]

### Nets
+5LL: C38.1 C39.1 C42.1 C44.1 I4.2 U18.5(+VS) U19.9(VDD) U20.5(+VS) U21.5(+VS)
+5VD: I4.1 ; also sheet 1,4,6
BLU_LL: U18.3(IN+) U19.1(VO_A)
GRN_LL: U19.2(VO_B) U21.3(IN+)
IGND: C46.2 R60.1 U22.2(GND) U22.7(GND1) U22.EP ; also sheet 1,4,6
IR_DRV_LL: C47.1 IR145.A IR145.A1(A) IR177.A IR177.A1(A) IR209.A IR209.A1(A) IR240.A IR240.A1(A) R61.1 U22.1(SET)
IR_LL: R60.2 U19.5(VO_D) U22.8(CTRL)
IR_RET_UL1: C47.2 L4.1 R54.2 R55.2 R56.2 R58.2
LGND: C36.2 C38.2 C39.2 C40.2 C41.2 C42.2 C43.2 C44.2 R43.1 R44.1 R48.1 R49.1 R53.1 R57.1 U18.2(-VS) U19.3(GND) U20.2(-VS) U21.2(-VS) ; also sheet 1,4,6
LL_EN: U19.6(!SYNC) ; also sheet 1
MOSI: U19.8(DIN) ; also sheet 1,4,6
N$59: IR135.A IR135.A1(A) IR136.C(K)
N$62: IR134.A IR134.A1(A) IR135.C1(K) IR135.C(K)
N$76: IR133.A IR133.A1(A) IR134.C1(K) IR134.C(K)
N$90: C40.1 U19.10(REFIO)
N$122: IR131.A IR131.A1(A) IR132.C1(K) IR132.C(K)
N$127: IR130.A IR130.A1(A) IR131.C1(K) IR131.C(K)
N$128: IR129.A IR129.A1(A) IR130.C1(K) IR130.C(K)
N$130: IR145.C1(K) IR145.C(K) IR146.A IR146.A1(A)
N$132: IR146.C1(K) IR146.C(K) IR147.A IR147.A1(A)
N$133: IR147.C1(K) IR147.C(K) IR148.A IR148.A1(A)
N$134: IR132.A IR132.A1(A) IR133.C1(K) IR133.C(K)
N$135: IR167.A IR167.A1(A) IR168.C1(K) IR168.C(K)
N$136: IR166.A IR166.A1(A) IR167.C1(K) IR167.C(K)
N$137: IR165.A IR165.A1(A) IR166.C1(K) IR166.C(K)
N$138: IR164.A IR164.A1(A) IR165.C1(K) IR165.C(K)
N$139: IR163.A IR163.A1(A) IR164.C1(K) IR164.C(K)
N$140: IR162.A IR162.A1(A) IR163.C1(K) IR163.C(K)
N$141: IR161.A IR161.A1(A) IR162.C1(K) IR162.C(K)
N$142: IR149.C1(K) IR149.C(K) IR150.A IR150.A1(A)
N$143: IR150.C1(K) IR150.C(K) IR151.A IR151.A1(A)
N$144: IR151.C1(K) IR151.C(K) IR152.A IR152.A1(A)
N$145: IR177.C1(K) IR177.C(K) IR178.A IR178.A1(A)
N$146: IR178.C1(K) IR178.C(K) IR179.A IR179.A1(A)
N$147: IR179.C1(K) IR179.C(K) IR180.A IR180.A1(A)
N$148: IR181.C1(K) IR181.C(K) IR182.A IR182.A1(A)
N$149: IR182.C1(K) IR182.C(K) IR183.A IR183.A1(A)
N$150: IR183.C1(K) IR183.C(K) IR184.A IR184.A1(A)
N$151: IR148.C1(K) IR148.C(K) IR149.A IR149.A1(A)
N$152: IR136.A IR152.C1(K) IR152.C(K)
N$153: IR180.C1(K) IR180.C(K) IR181.A IR181.A1(A)
N$154: IR168.A IR168.A1(A) IR184.C1(K) IR184.C(K)
N$155: IR129.C(K) R54.1
N$156: IR161.C1(K) IR161.C(K) R55.1
N$157: IR199.A IR199.A1(A) IR200.C1(K) IR200.C(K)
N$158: IR198.A IR198.A1(A) IR199.C1(K) IR199.C(K)
N$159: IR197.A IR197.A1(A) IR198.C1(K) IR198.C(K)
N$160: IR195.A IR195.A1(A) IR196.C1(K) IR196.C(K)
N$161: IR194.A IR194.A1(A) IR195.C1(K) IR195.C(K)
N$162: IR193.A IR193.A1(A) IR194.C1(K) IR194.C(K)
N$163: IR209.C1(K) IR209.C(K) IR210.A IR210.A1(A)
N$164: IR210.C1(K) IR210.C(K) IR211.A IR211.A1(A)
N$165: IR211.C1(K) IR211.C(K) IR212.A IR212.A1(A)
N$166: IR196.A IR196.A1(A) IR197.C1(K) IR197.C(K)
N$167: IR230.A IR230.A1(A) IR231.C1(K) IR231.C(K)
N$168: IR229.A IR229.A1(A) IR230.C1(K) IR230.C(K)
N$169: IR228.A IR228.A1(A) IR229.C1(K) IR229.C(K)
N$170: IR227.A IR227.A1(A) IR228.C1(K) IR228.C(K)
N$171: IR226.A IR226.A1(A) IR227.C1(K) IR227.C(K)
N$172: IR225.A IR225.A1(A) IR226.C1(K) IR226.C(K)
N$173: IR224.A IR224.A1(A) IR225.C1(K) IR225.C(K)
N$174: IR213.C1(K) IR213.C(K) IR214.A IR214.A1(A)
N$175: IR214.C1(K) IR214.C(K) IR215.A IR215.A1(A)
N$176: IR215.C1(K) IR215.C(K) IR216.A IR216.A1(A)
N$177: IR240.C1(K) IR240.C(K) IR241.A IR241.A1(A)
N$178: IR241.C1(K) IR241.C(K) IR242.A IR242.A1(A)
N$179: IR242.C1(K) IR242.C(K) IR248.A IR248.A1(A)
N$180: IR243.C1(K) IR243.C(K) IR249.A IR249.A1(A)
N$181: IR249.C1(K) IR249.C(K) IR250.A IR250.A1(A)
N$182: IR250.C1(K) IR250.C(K) IR251.A
N$183: IR212.C1(K) IR212.C(K) IR213.A IR213.A1(A)
N$184: IR200.A IR200.A1(A) IR216.C1(K) IR216.C(K)
N$185: IR243.A IR243.A1(A) IR248.C1(K) IR248.C(K)
N$186: IR231.A IR231.A1(A) IR251.C(K)
N$187: IR193.C1(K) IR193.C(K) R56.1
N$188: IR224.C1(K) IR224.C(K) R58.1
N$189: Q10.3(E2) R44.2 R46.1 U18.4(IN-)
N$190: D5.A L4.2 U22.5(SW) U22.6(SW1)
N$191: Q11.3(E2) R49.2 R50.1 U20.4(IN-)
N$193: Q11.2(B1) Q11.4(B2) U20.1(OUT)
N$194: RGB41.6(GC) RGB41.6A(GC) RGB41.6B(GC) RGB42.1(GA) RGB42.1A(GA) RGB42.1B(GA)
N$195: RGB41.5(RC) RGB41.5A(RC) RGB41.5B(RC) RGB42.2(RA) RGB42.2A(RA) RGB42.2B(RA)
N$196: RGB41.4(BC) RGB41.4A(BC) RGB41.4B(BC) RGB42.3(BA) RGB42.3A(BA) RGB42.3B(BA)
N$197: RGB42.6(GC) RGB42.6A(GC) RGB42.6B(GC) RGB43.1(GA) RGB43.1A(GA) RGB43.1B(GA)
N$198: RGB42.5(RC) RGB42.5A(RC) RGB42.5B(RC) RGB43.2(RA) RGB43.2A(RA) RGB43.2B(RA)
N$199: RGB42.4(BC) RGB42.4A(BC) RGB42.4B(BC) RGB43.3(BA) RGB43.3A(BA) RGB43.3B(BA)
N$200: RGB43.6(GC) RGB43.6A(GC) RGB43.6B(GC) RGB44.1(GA) RGB44.1A(GA) RGB44.1B(GA)
N$202: RGB43.5(RC) RGB43.5A(RC) RGB43.5B(RC) RGB44.2(RA) RGB44.2A(RA) RGB44.2B(RA)
N$204: RGB43.4(BC) RGB43.4A(BC) RGB43.4B(BC) RGB44.3(BA) RGB44.3A(BA) RGB44.3B(BA)
N$205: RGB36.1(GA) RGB36.1A(GA) RGB36.1B(GA) RGB44.6(GC) RGB44.6A(GC) RGB44.6B(GC)
N$206: RGB36.2(RA) RGB36.2A(RA) RGB36.2B(RA) RGB44.5(RC) RGB44.5A(RC) RGB44.5B(RC)
N$207: RGB36.3(BA) RGB36.3A(BA) RGB36.3B(BA) RGB44.4(BC) RGB44.4A(BC) RGB44.4B(BC)
N$209: RGB35.1(GA) RGB35.1A(GA) RGB35.1B(GA) RGB36.6(GC) RGB36.6A(GC) RGB36.6B(GC)
N$210: RGB35.2(RA) RGB35.2A(RA) RGB35.2B(RA) RGB36.5(RC) RGB36.5A(RC) RGB36.5B(RC)
N$211: RGB35.3(BA) RGB35.3A(BA) RGB35.3B(BA) RGB36.4(BC) RGB36.4A(BC) RGB36.4B(BC)
N$212: RGB34.1(GA) RGB34.1A(GA) RGB34.1B(GA) RGB35.6(GC) RGB35.6A(GC) RGB35.6B(GC)
N$213: RGB34.2(RA) RGB34.2A(RA) RGB34.2B(RA) RGB35.5(RC) RGB35.5A(RC) RGB35.5B(RC)
N$214: RGB34.3(BA) RGB34.3A(BA) RGB34.3B(BA) RGB35.4(BC) RGB35.4A(BC) RGB35.4B(BC)
N$215: RGB33.1(GA) RGB33.1A(GA) RGB33.1B(GA) RGB34.6(GC) RGB34.6A(GC) RGB34.6B(GC)
N$216: RGB33.2(RA) RGB33.2A(RA) RGB33.2B(RA) RGB34.5(RC) RGB34.5A(RC) RGB34.5B(RC)
N$217: RGB33.3(BA) RGB33.3A(BA) RGB33.3B(BA) RGB34.4(BC) RGB34.4A(BC) RGB34.4B(BC)
N$219: Q12.3(E2) R57.2 R59.1 U21.4(IN-)
N$220: Q12.2(B1) Q12.4(B2) U21.1(OUT)
N$222: RGB57.6(GC) RGB57.6A(GC) RGB57.6B(GC) RGB58.1(GA) RGB58.1A(GA) RGB58.1B(GA)
N$223: RGB57.5(RC) RGB57.5A(RC) RGB57.5B(RC) RGB58.2(RA) RGB58.2A(RA) RGB58.2B(RA)
N$224: RGB57.4(BC) RGB57.4A(BC) RGB57.4B(BC) RGB58.3(BA) RGB58.3A(BA) RGB58.3B(BA)
N$225: RGB58.6(GC) RGB58.6A(GC) RGB58.6B(GC) RGB59.1(GA) RGB59.1A(GA) RGB59.1B(GA)
N$226: RGB58.5(RC) RGB58.5A(RC) RGB58.5B(RC) RGB59.2(RA) RGB59.2A(RA) RGB59.2B(RA)
N$227: RGB58.4(BC) RGB58.4A(BC) RGB58.4B(BC) RGB59.3(BA) RGB59.3A(BA) RGB59.3B(BA)
N$228: RGB59.6(GC) RGB59.6A(GC) RGB59.6B(GC) RGB60.1(GA) RGB60.1A(GA) RGB60.1B(GA)
N$229: RGB59.5(RC) RGB59.5A(RC) RGB59.5B(RC) RGB60.2(RA) RGB60.2A(RA) RGB60.2B(RA)
N$230: RGB59.4(BC) RGB59.4A(BC) RGB59.4B(BC) RGB60.3(BA) RGB60.3A(BA) RGB60.3B(BA)
N$231: RGB52.1(GA) RGB52.1A(GA) RGB52.1B(GA) RGB60.6(GC) RGB60.6A(GC) RGB60.6B(GC)
N$232: RGB52.2(RA) RGB52.2A(RA) RGB52.2B(RA) RGB60.5(RC) RGB60.5A(RC) RGB60.5B(RC)
N$233: RGB52.3(BA) RGB52.3A(BA) RGB52.3B(BA) RGB60.4(BC) RGB60.4A(BC) RGB60.4B(BC)
N$234: RGB51.1(GA) RGB51.1A(GA) RGB51.1B(GA) RGB52.6(GC) RGB52.6A(GC) RGB52.6B(GC)
N$235: RGB51.2(RA) RGB51.2A(RA) RGB51.2B(RA) RGB52.5(RC) RGB52.5A(RC) RGB52.5B(RC)
N$236: RGB51.3(BA) RGB51.3A(BA) RGB51.3B(BA) RGB52.4(BC) RGB52.4A(BC) RGB52.4B(BC)
N$237: RGB50.1(GA) RGB50.1A(GA) RGB50.1B(GA) RGB51.6(GC) RGB51.6A(GC) RGB51.6B(GC)
N$238: RGB50.2(RA) RGB50.2A(RA) RGB50.2B(RA) RGB51.5(RC) RGB51.5A(RC) RGB51.5B(RC)
N$239: RGB50.3(BA) RGB50.3A(BA) RGB50.3B(BA) RGB51.4(BC) RGB51.4A(BC) RGB51.4B(BC)
N$240: RGB49.1(GA) RGB49.1A(GA) RGB49.1B(GA) RGB50.6(GC) RGB50.6A(GC) RGB50.6B(GC)
N$241: RGB49.2(RA) RGB49.2A(RA) RGB49.2B(RA) RGB50.5(RC) RGB50.5A(RC) RGB50.5B(RC)
N$242: RGB49.3(BA) RGB49.3A(BA) RGB49.3B(BA) RGB50.4(BC) RGB50.4A(BC) RGB50.4B(BC)
N$243: Q10.2(B1) Q10.4(B2) U18.1(OUT)
N$245: Q10.1(E1) R43.2
N$246: Q11.1(E1) R48.2
N$249: Q12.1(E1) R53.2
Q4A: Q10.7(C1) Q10.8(C1) Q10.8A(C1) Q10.8B(C1) Q10.8C1(C1) Q10.8C2(C1) Q10.8C3(C1) Q10.8C(C1) Q10.78(C1) Q10.78A(C1) Q10.78B(C1) RGB33.4(BC) RGB33.4A(BC) RGB33.4B(BC)
Q4B: Q10.5(C2) Q10.5A1(C2) Q10.5A(C2) Q10.5B(C2) Q10.5C1(C2) Q10.5C2(C2) Q10.5C(C2) Q10.6(C2) Q10.56(C2) Q10.56A(C2) Q10.56B(C2) RGB49.4(BC) RGB49.4A(BC) RGB49.4B(BC)
Q5A: Q11.7(C1) Q11.8(C1) Q11.8A(C1) Q11.8B(C1) Q11.8C1(C1) Q11.8C2(C1) Q11.8C3(C1) Q11.8C(C1) Q11.78(C1) Q11.78A(C1) Q11.78B(C1) RGB33.5(RC) RGB33.5A(RC) RGB33.5B(RC)
Q5B: Q11.5(C2) Q11.5A1(C2) Q11.5A(C2) Q11.5B(C2) Q11.5C1(C2) Q11.5C2(C2) Q11.5C(C2) Q11.6(C2) Q11.56(C2) Q11.56A(C2) Q11.56B(C2) RGB49.5(RC) RGB49.5A(RC) RGB49.5B(RC)
Q6A: Q12.7(C1) Q12.8(C1) Q12.8A(C1) Q12.8B(C1) Q12.8C1(C1) Q12.8C2(C1) Q12.8C3(C1) Q12.8C(C1) Q12.78(C1) Q12.78A(C1) Q12.78B(C1) RGB33.6(GC) RGB33.6A(GC) RGB33.6B(GC)
Q6B: Q12.5(C2) Q12.5A1(C2) Q12.5A(C2) Q12.5B(C2) Q12.5C1(C2) Q12.5C2(C2) Q12.5C(C2) Q12.6(C2) Q12.56(C2) Q12.56A(C2) Q12.56B(C2) RGB49.6(GC) RGB49.6A(GC) RGB49.6B(GC)
RED_LL: U19.4(VO_C) U20.3(IN+)
SCLK: U19.7(SCLK) ; also sheet 1,4,6
V_IR: C46.1 D5.K R61.2 U22.4(VIN) ; also sheet 1,4,6
V_RGB: C36.1 C41.1 C43.1 R46.2 R50.2 R59.2 RGB41.1(GA) RGB41.1A(GA) RGB41.1B(GA) RGB41.2(RA) RGB41.2A(RA) RGB41.2B(RA) RGB41.3(BA) RGB41.3A(BA) RGB41.3B(BA) RGB57.1(GA) RGB57.1A(GA) RGB57.1B(GA) RGB57.2(RA) RGB57.2A(RA) RGB57.2B(RA) RGB57.3(BA) RGB57.3A(BA) RGB57.3B(BA) ; also sheet 1,4,6
Unconnected: U22.3(N/C)

### Notes on the sheet
- LL

## Sheet 4 of 6
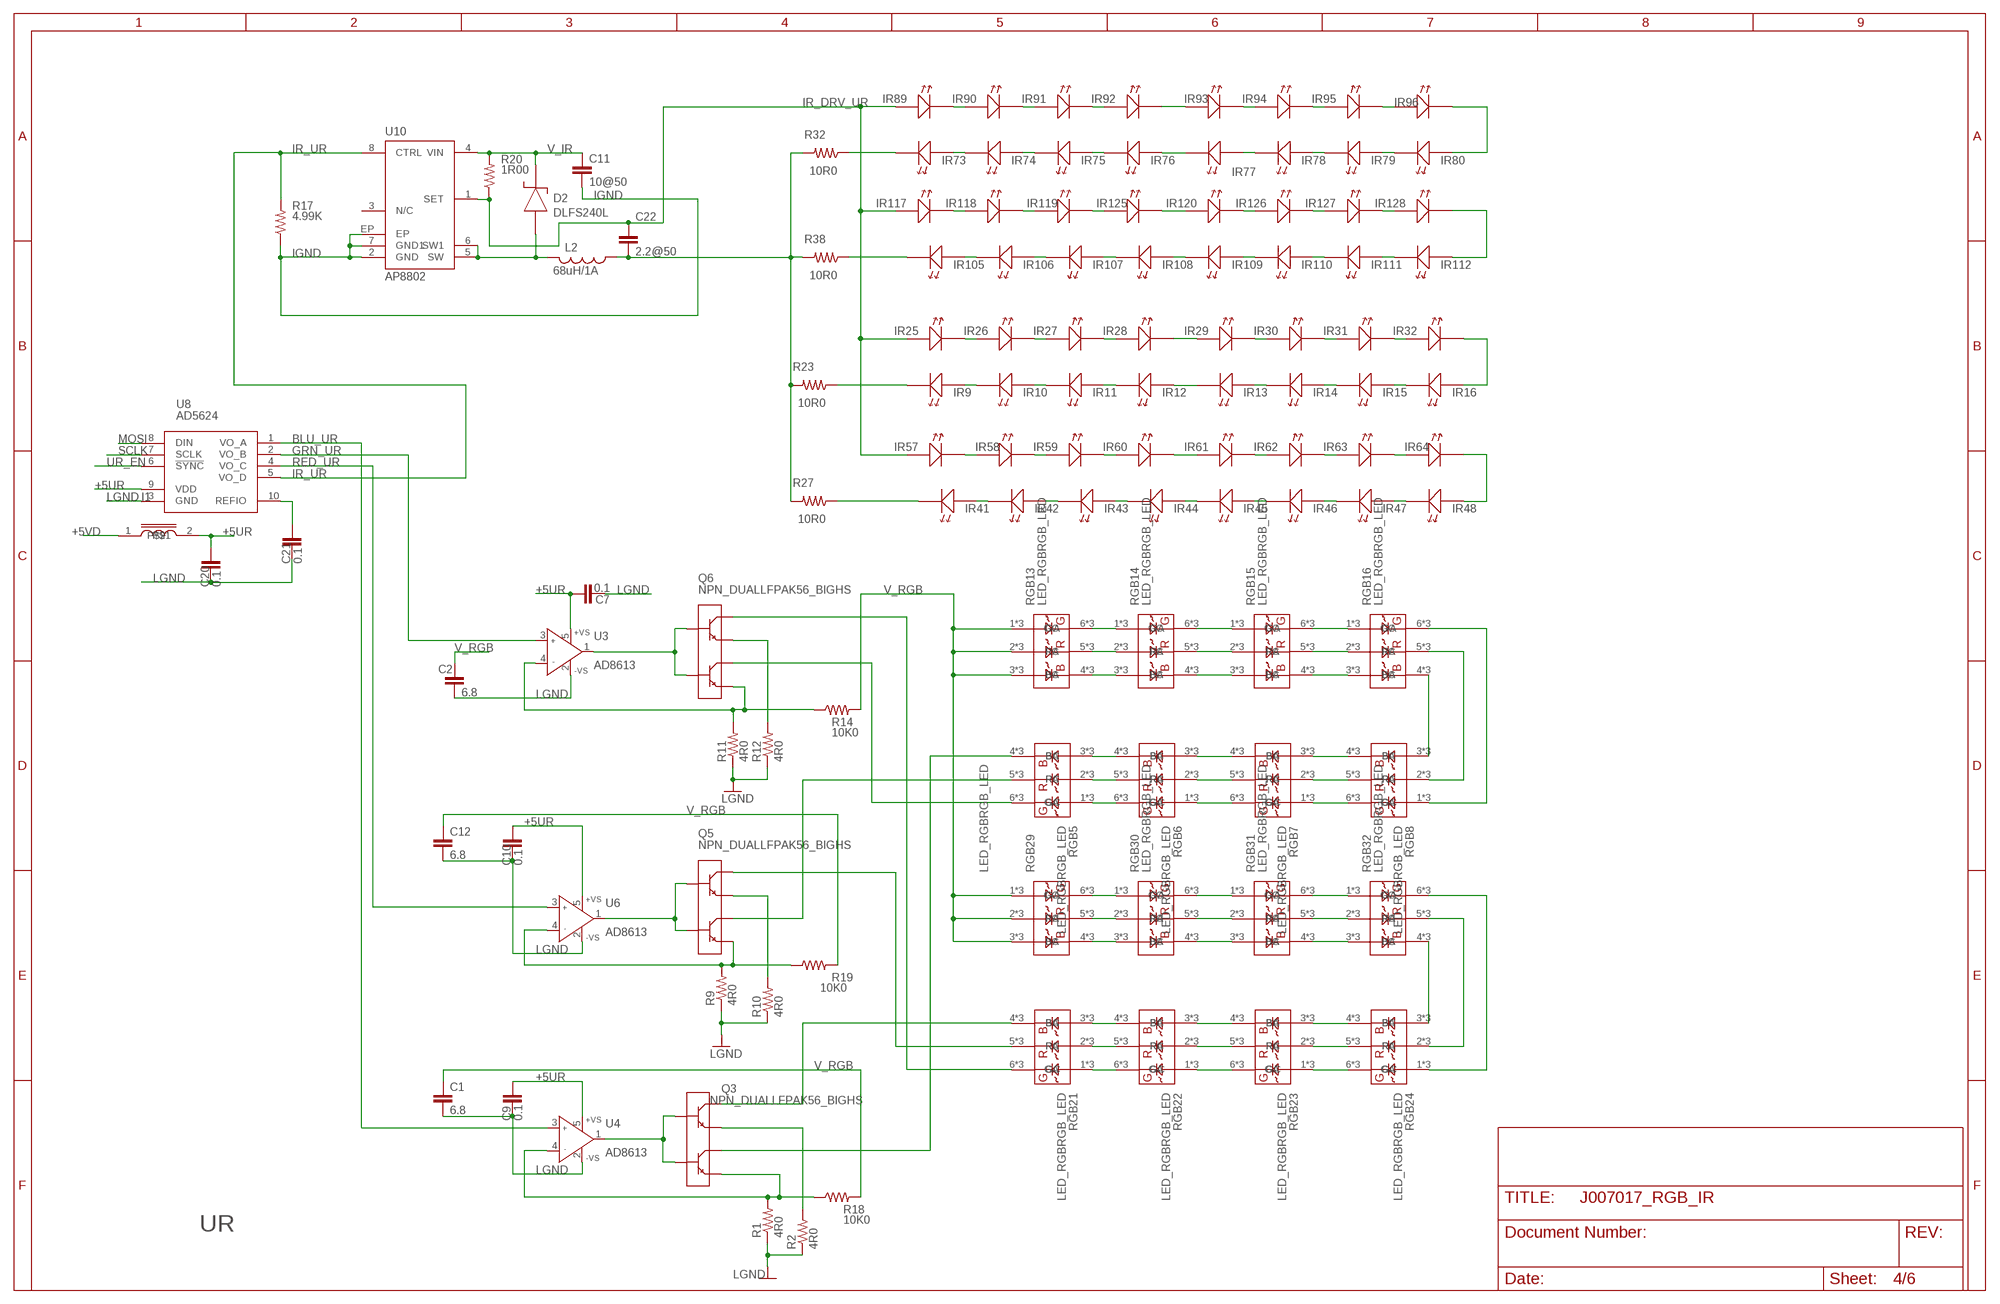
[diagram p2: schematic, sheet 4]

### Parts
C1  6.8  CAPS1210S  [1210S]
C2  6.8  CAPS1210S  [1210S]
C7  0.1  CAPS0603S  [0603S]
C9  0.1  CAPS0603S  [0603S]
C10  0.1  CAPS0603S  [0603S]
C11  10@50  CAPS1210S  [1210S]
C12  6.8  CAPS1210S  [1210S]
C20  0.1  CAPS0603S  [0603S]
C21  0.1  CAPS0603S  [0603S]
C22  2.2@50  CAPS1206S  [1206S]
D2  DLFS240L  DIODE_SCHOTTKYPWRDI-123  [PWRDI-123]
I1  INDUCTOR0805S  [0805S]
IR9  LEDLED_SFH4050_HEAT  [LED_SFH4050_HEAT]
IR10  LEDLED_SFH4050_HEAT  [LED_SFH4050_HEAT]
IR11  LEDLED_SFH4050_HEAT  [LED_SFH4050_HEAT]
IR12  LEDLED_SFH4050_HEAT  [LED_SFH4050_HEAT]
IR13  LEDLED_SFH4050_HEAT  [LED_SFH4050_HEAT]
IR14  LEDLED_SFH4050_HEAT  [LED_SFH4050_HEAT]
IR15  LEDLED_SFH4050_HEAT  [LED_SFH4050_HEAT]
IR16  LEDLED_SFH4050_HEAT  [LED_SFH4050_HEAT]
IR25  LEDLED_SFH4050_HEAT  [LED_SFH4050_HEAT]
IR26  LEDLED_SFH4050_HEAT  [LED_SFH4050_HEAT]
IR27  LEDLED_SFH4050_HEAT  [LED_SFH4050_HEAT]
IR28  LEDLED_SFH4050_HEAT  [LED_SFH4050_HEAT]
IR29  LEDLED_SFH4050_HEAT  [LED_SFH4050_HEAT]
IR30  LEDLED_SFH4050_HEAT  [LED_SFH4050_HEAT]
IR31  LEDLED_SFH4050_HEAT  [LED_SFH4050_HEAT]
IR32  LEDLED_SFH4050_HEAT  [LED_SFH4050_HEAT]
IR41  LEDLED_SFH4050_HEAT  [LED_SFH4050_HEAT]
IR42  LEDLED_SFH4050_HEAT  [LED_SFH4050_HEAT]
IR43  LEDLED_SFH4050_HEAT  [LED_SFH4050_HEAT]
IR44  LEDLED_SFH4050_HEAT  [LED_SFH4050_HEAT]
IR45  LEDLED_SFH4050_HEAT  [LED_SFH4050_HEAT]
IR46  LEDLED_SFH4050_HEAT  [LED_SFH4050_HEAT]
IR47  LEDLED_SFH4050_HEAT  [LED_SFH4050_HEAT]
IR48  LEDLED_SFH4050_HEAT  [LED_SFH4050_HEAT]
IR57  LEDLED_SFH4050_HEAT  [LED_SFH4050_HEAT]
IR58  LEDLED_SFH4050_HEAT  [LED_SFH4050_HEAT]
IR59  LEDLED_SFH4050_HEAT  [LED_SFH4050_HEAT]
IR60  LEDLED_SFH4050_HEAT  [LED_SFH4050_HEAT]
IR61  LEDLED_SFH4050_HEAT  [LED_SFH4050_HEAT]
IR62  LEDLED_SFH4050_HEAT  [LED_SFH4050_HEAT]
IR63  LEDLED_SFH4050_HEAT  [LED_SFH4050_HEAT]
IR64  LEDLED_SFH4050_HEAT  [LED_SFH4050_HEAT]
IR73  LEDLED_SFH4050_HEAT  [LED_SFH4050_HEAT]
IR74  LEDLED_SFH4050_HEAT  [LED_SFH4050_HEAT]
IR75  LEDLED_SFH4050_HEAT  [LED_SFH4050_HEAT]
IR76  LEDLED_SFH4050_HEAT  [LED_SFH4050_HEAT]
IR77  LEDLED_SFH4050_HEAT  [LED_SFH4050_HEAT]
IR78  LEDLED_SFH4050_HEAT  [LED_SFH4050_HEAT]
IR79  LEDLED_SFH4050_HEAT  [LED_SFH4050_HEAT]
IR80  LEDLED_SFH4050_HEAT  [LED_SFH4050_HEAT]
IR89  LEDLED_SFH4050_HEAT  [LED_SFH4050_HEAT]
IR90  LEDLED_SFH4050_HEAT  [LED_SFH4050_HEAT]
IR91  LEDLED_SFH4050_HEAT  [LED_SFH4050_HEAT]
IR92  LEDLED_SFH4050_HEAT  [LED_SFH4050_HEAT]
IR93  LEDLED_SFH4050_HEAT  [LED_SFH4050_HEAT]
IR94  LEDLED_SFH4050_HEAT  [LED_SFH4050_HEAT]
IR95  LEDLED_SFH4050_HEAT  [LED_SFH4050_HEAT]
IR96  LEDLED_SFH4050_HEAT  [LED_SFH4050_HEAT]
IR105  LEDLED_SFH4050_HEAT  [LED_SFH4050_HEAT]
IR106  LEDLED_SFH4050_C  [LED_SFH4050_HEAT_C]
IR107  LEDLED_SFH4050_HEAT  [LED_SFH4050_HEAT]
IR108  LEDLED_SFH4050_HEAT  [LED_SFH4050_HEAT]
IR109  LEDLED_SFH4050_HEAT  [LED_SFH4050_HEAT]
IR110  LEDLED_SFH4050_HEAT  [LED_SFH4050_HEAT]
IR111  LEDLED_SFH4050_HEAT  [LED_SFH4050_HEAT]
IR112  LEDLED_SFH4050_HEAT  [LED_SFH4050_HEAT]
IR117  LEDLED_SFH4050  [LED_SFH4050]
IR118  LEDLED_SFH4050_HEAT  [LED_SFH4050_HEAT]
IR119  LEDLED_SFH4050_HEAT  [LED_SFH4050_HEAT]
IR120  LEDLED_SFH4050_HEAT  [LED_SFH4050_HEAT]
IR125  LEDLED_SFH4050_HEAT  [LED_SFH4050_HEAT]
IR126  LEDLED_SFH4050_HEAT  [LED_SFH4050_HEAT]
IR127  LEDLED_SFH4050_HEAT  [LED_SFH4050_HEAT]
IR128  LEDLED_SFH4050  [LED_SFH4050]
L2  68uH/1A  INDUCTOR_SMSRU8043  [SRU8043]
Q3  NPN_DUALLFPAK56_BIGHS  [LFPAK56_HS2]
Q5  NPN_DUALLFPAK56_BIGHS  [LFPAK56_HS2]
Q6  NPN_DUALLFPAK56_BIGHS  [LFPAK56_HS2]
R1  4R0  RESISTOR-POWER1812  [1812]
R2  4R0  RESISTOR-POWER1812  [1812]
R9  4R0  RESISTOR-POWER1812  [1812]
R10  4R0  RESISTOR-POWER1812  [1812]
R11  4R0  RESISTOR-POWER1812  [1812]
R12  4R0  RESISTOR-POWER1812  [1812]
R14  10K0  RESISTOR_SM1206S  [1206S]
R17  4.99K  RESISTOR_SM0805S  [0805S]
R18  10K0  RESISTOR_SM1206S  [1206S]
R19  10K0  RESISTOR_SM1206S  [1206S]
R20  1R00  RESISTOR_SM1206S  [1206S]
R23  10R0  RESISTOR_SM1206S  [1206S]
R27  10R0  RESISTOR_SM1206S  [1206S]
R32  10R0  RESISTOR_SM1206S  [1206S]
R38  10R0  RESISTOR_SM1206S  [1206S]
RGB5  LED_RGBRGB_LED  [OVSPRGB_HS_FIXED]
RGB6  LED_RGBRGB_LED  [OVSPRGB_HS_FIXED]
RGB7  LED_RGBRGB_LED  [OVSPRGB_HS_FIXED]
RGB8  LED_RGBRGB_LED  [OVSPRGB_HS_FIXED]
RGB13  LED_RGBRGB_LED  [OVSPRGB_HS_FIXED]
RGB14  LED_RGBRGB_LED  [OVSPRGB_HS_FIXED]
RGB15  LED_RGBRGB_LED  [OVSPRGB_HS_FIXED]
RGB16  LED_RGBRGB_LED  [OVSPRGB_HS_FIXED]
RGB21  LED_RGBRGB_LED  [OVSPRGB_HS_FIXED]
RGB22  LED_RGBRGB_LED  [OVSPRGB_HS_FIXED]
RGB23  LED_RGBRGB_LED  [OVSPRGB_HS_FIXED]
RGB24  LED_RGBRGB_LED  [OVSPRGB_HS_FIXED]
RGB29  LED_RGBRGB_LED  [OVSPRGB_HS_FIXED]
RGB30  LED_RGBRGB_LED  [OVSPRGB_HS_FIXED]
RGB31  LED_RGBRGB_LED  [OVSPRGB_HS_FIXED]
RGB32  LED_RGBRGB_LED  [OVSPRGB_HS_FIXED]
U3  AD8613  AD8065RT  [SOT23-5]
U4  AD8613  AD8065RT  [SOT23-5]
U6  AD8613  AD8065RT  [SOT23-5]
U8  AD5624  AD56X4R  [MSOP10]
U10  AP8802  [SOIC8-EP]

### Nets
+5UR: C7.1 C9.1 C10.1 C20.1 I1.2 U3.5(+VS) U4.5(+VS) U6.5(+VS) U8.9(VDD)
+5VD: I1.1 ; also sheet 1,3,6
BLU_UR: U4.3(IN+) U8.1(VO_A)
GRN_UR: U3.3(IN+) U8.2(VO_B)
IGND: C11.2 R17.1 U10.2(GND) U10.7(GND1) U10.EP ; also sheet 1,3,6
IR_DRV_UR: C22.1 IR25.A IR25.A1(A) IR57.A IR57.A1(A) IR89.A IR89.A1(A) IR117.A R20.1 U10.1(SET)
IR_RET_UL2: C22.2 L2.1 R23.2 R27.2 R32.2 R38.2
IR_UR: R17.2 U8.5(VO_D) U10.8(CTRL)
LGND: C1.2 C2.2 C7.2 C9.2 C10.2 C12.2 C20.2 C21.2 R1.1 R2.1 R9.1 R10.1 R11.1 R12.1 U3.2(-VS) U4.2(-VS) U6.2(-VS) U8.3(GND) ; also sheet 1,3,6
MOSI: U8.8(DIN) ; also sheet 1,3,6
N$96: C21.1 U8.10(REFIO)
N$258: IR15.A IR15.A1(A) IR16.C1(K) IR16.C(K)
N$259: IR14.A IR14.A1(A) IR15.C1(K) IR15.C(K)
N$260: IR13.A IR13.A1(A) IR14.C1(K) IR14.C(K)
N$261: IR11.A IR11.A1(A) IR12.C1(K) IR12.C(K)
N$262: IR10.A IR10.A1(A) IR11.C1(K) IR11.C(K)
N$263: IR9.A IR9.A1(A) IR10.C1(K) IR10.C(K)
N$264: IR25.C1(K) IR25.C(K) IR26.A IR26.A1(A)
N$265: IR26.C1(K) IR26.C(K) IR27.A IR27.A1(A)
N$266: IR27.C1(K) IR27.C(K) IR28.A IR28.A1(A)
N$267: IR12.A IR12.A1(A) IR13.C1(K) IR13.C(K)
N$268: IR47.A IR47.A1(A) IR48.C1(K) IR48.C(K)
N$269: IR46.A IR46.A1(A) IR47.C1(K) IR47.C(K)
N$270: IR45.A IR45.A1(A) IR46.C1(K) IR46.C(K)
N$271: IR44.A IR44.A1(A) IR45.C1(K) IR45.C(K)
N$272: IR43.A IR43.A1(A) IR44.C1(K) IR44.C(K)
N$273: IR42.A IR42.A1(A) IR43.C1(K) IR43.C(K)
N$274: IR41.A IR41.A1(A) IR42.C1(K) IR42.C(K)
N$275: IR29.C1(K) IR29.C(K) IR30.A IR30.A1(A)
N$276: IR30.C1(K) IR30.C(K) IR31.A IR31.A1(A)
N$277: IR31.C1(K) IR31.C(K) IR32.A IR32.A1(A)
N$278: IR57.C1(K) IR57.C(K) IR58.A IR58.A1(A)
N$279: IR58.C1(K) IR58.C(K) IR59.A IR59.A1(A)
N$280: IR59.C1(K) IR59.C(K) IR60.A IR60.A1(A)
N$281: IR61.C1(K) IR61.C(K) IR62.A IR62.A1(A)
N$282: IR62.C1(K) IR62.C(K) IR63.A IR63.A1(A)
N$283: IR63.C1(K) IR63.C(K) IR64.A IR64.A1(A)
N$284: IR28.C1(K) IR28.C(K) IR29.A IR29.A1(A)
N$285: IR16.A IR16.A1(A) IR32.C1(K) IR32.C(K)
N$286: IR60.C1(K) IR60.C(K) IR61.A IR61.A1(A)
N$287: IR48.A IR48.A1(A) IR64.C1(K) IR64.C(K)
N$288: IR9.C1(K) IR9.C(K) R23.1
N$289: IR41.C1(K) IR41.C(K) R27.1
N$290: IR79.A IR79.A1(A) IR80.C1(K) IR80.C(K)
N$291: IR78.A IR78.A1(A) IR79.C1(K) IR79.C(K)
N$292: IR77.A IR77.A1(A) IR78.C1(K) IR78.C(K)
N$293: IR75.A IR75.A1(A) IR76.C1(K) IR76.C(K)
N$294: IR74.A IR74.A1(A) IR75.C1(K) IR75.C(K)
N$295: IR73.A IR73.A1(A) IR74.C1(K) IR74.C(K)
N$296: IR89.C1(K) IR89.C(K) IR90.A IR90.A1(A)
N$297: IR90.C1(K) IR90.C(K) IR91.A IR91.A1(A)
N$298: IR91.C1(K) IR91.C(K) IR92.A IR92.A1(A)
N$299: IR76.A IR76.A1(A) IR77.C1(K) IR77.C(K)
N$300: IR111.A IR111.A1(A) IR112.C1(K) IR112.C(K)
N$301: IR110.A IR110.A1(A) IR111.C1(K) IR111.C(K)
N$302: IR109.A IR109.A1(A) IR110.C1(K) IR110.C(K)
N$303: IR108.A IR108.A1(A) IR109.C1(K) IR109.C(K)
N$304: IR107.A IR107.A1(A) IR108.C1(K) IR108.C(K)
N$305: IR106.A IR107.C1(K) IR107.C(K)
N$306: IR105.A IR105.A1(A) IR106.C1(K) IR106.C(K)
N$307: IR93.C1(K) IR93.C(K) IR94.A IR94.A1(A)
N$308: IR94.C1(K) IR94.C(K) IR95.A IR95.A1(A)
N$309: IR95.C1(K) IR95.C(K) IR96.A IR96.A1(A)
N$310: IR117.C(K) IR118.A IR118.A1(A)
N$311: IR118.C1(K) IR118.C(K) IR119.A IR119.A1(A)
N$312: IR119.C1(K) IR119.C(K) IR125.A IR125.A1(A)
N$313: IR120.C1(K) IR120.C(K) IR126.A IR126.A1(A)
N$314: IR126.C1(K) IR126.C(K) IR127.A IR127.A1(A)
N$315: IR127.C1(K) IR127.C(K) IR128.A
N$316: IR92.C1(K) IR92.C(K) IR93.A IR93.A1(A)
N$317: IR80.A IR80.A1(A) IR96.C1(K) IR96.C(K)
N$318: IR120.A IR120.A1(A) IR125.C1(K) IR125.C(K)
N$319: IR112.A IR112.A1(A) IR128.C(K)
N$320: IR73.C1(K) IR73.C(K) R32.1
N$321: IR105.C1(K) IR105.C(K) R38.1
N$322: Q6.3(E2) R11.2 R14.1 U3.4(IN-)
N$323: D2.A L2.2 U10.5(SW) U10.6(SW1)
N$324: Q5.3(E2) R9.2 R19.1 U6.4(IN-)
N$325: Q5.2(B1) Q5.4(B2) U6.1(OUT)
N$326: RGB13.6(GC) RGB13.6A(GC) RGB13.6B(GC) RGB14.1(GA) RGB14.1A(GA) RGB14.1B(GA)
N$327: RGB13.5(RC) RGB13.5A(RC) RGB13.5B(RC) RGB14.2(RA) RGB14.2A(RA) RGB14.2B(RA)
N$328: RGB13.4(BC) RGB13.4A(BC) RGB13.4B(BC) RGB14.3(BA) RGB14.3A(BA) RGB14.3B(BA)
N$329: RGB14.6(GC) RGB14.6A(GC) RGB14.6B(GC) RGB15.1(GA) RGB15.1A(GA) RGB15.1B(GA)
N$330: RGB14.5(RC) RGB14.5A(RC) RGB14.5B(RC) RGB15.2(RA) RGB15.2A(RA) RGB15.2B(RA)
N$331: RGB14.4(BC) RGB14.4A(BC) RGB14.4B(BC) RGB15.3(BA) RGB15.3A(BA) RGB15.3B(BA)
N$332: RGB15.6(GC) RGB15.6A(GC) RGB15.6B(GC) RGB16.1(GA) RGB16.1A(GA) RGB16.1B(GA)
N$333: RGB15.5(RC) RGB15.5A(RC) RGB15.5B(RC) RGB16.2(RA) RGB16.2A(RA) RGB16.2B(RA)
N$334: RGB15.4(BC) RGB15.4A(BC) RGB15.4B(BC) RGB16.3(BA) RGB16.3A(BA) RGB16.3B(BA)
N$335: RGB8.1(GA) RGB8.1A(GA) RGB8.1B(GA) RGB16.6(GC) RGB16.6A(GC) RGB16.6B(GC)
N$336: RGB8.2(RA) RGB8.2A(RA) RGB8.2B(RA) RGB16.5(RC) RGB16.5A(RC) RGB16.5B(RC)
N$337: RGB8.3(BA) RGB8.3A(BA) RGB8.3B(BA) RGB16.4(BC) RGB16.4A(BC) RGB16.4B(BC)
N$338: RGB7.1(GA) RGB7.1A(GA) RGB7.1B(GA) RGB8.6(GC) RGB8.6A(GC) RGB8.6B(GC)
N$339: RGB7.2(RA) RGB7.2A(RA) RGB7.2B(RA) RGB8.5(RC) RGB8.5A(RC) RGB8.5B(RC)
N$340: RGB7.3(BA) RGB7.3A(BA) RGB7.3B(BA) RGB8.4(BC) RGB8.4A(BC) RGB8.4B(BC)
N$341: RGB6.1(GA) RGB6.1A(GA) RGB6.1B(GA) RGB7.6(GC) RGB7.6A(GC) RGB7.6B(GC)
N$342: RGB6.2(RA) RGB6.2A(RA) RGB6.2B(RA) RGB7.5(RC) RGB7.5A(RC) RGB7.5B(RC)
N$343: RGB6.3(BA) RGB6.3A(BA) RGB6.3B(BA) RGB7.4(BC) RGB7.4A(BC) RGB7.4B(BC)
N$344: RGB5.1(GA) RGB5.1A(GA) RGB5.1B(GA) RGB6.6(GC) RGB6.6A(GC) RGB6.6B(GC)
N$345: RGB5.2(RA) RGB5.2A(RA) RGB5.2B(RA) RGB6.5(RC) RGB6.5A(RC) RGB6.5B(RC)
N$346: RGB5.3(BA) RGB5.3A(BA) RGB5.3B(BA) RGB6.4(BC) RGB6.4A(BC) RGB6.4B(BC)
N$348: Q3.3(E2) R1.2 R18.1 U4.4(IN-)
N$349: Q3.2(B1) Q3.4(B2) U4.1(OUT)
N$351: RGB29.6(GC) RGB29.6A(GC) RGB29.6B(GC) RGB30.1(GA) RGB30.1A(GA) RGB30.1B(GA)
N$352: RGB29.5(RC) RGB29.5A(RC) RGB29.5B(RC) RGB30.2(RA) RGB30.2A(RA) RGB30.2B(RA)
N$353: RGB29.4(BC) RGB29.4A(BC) RGB29.4B(BC) RGB30.3(BA) RGB30.3A(BA) RGB30.3B(BA)
N$354: RGB30.6(GC) RGB30.6A(GC) RGB30.6B(GC) RGB31.1(GA) RGB31.1A(GA) RGB31.1B(GA)
N$355: RGB30.5(RC) RGB30.5A(RC) RGB30.5B(RC) RGB31.2(RA) RGB31.2A(RA) RGB31.2B(RA)
N$356: RGB30.4(BC) RGB30.4A(BC) RGB30.4B(BC) RGB31.3(BA) RGB31.3A(BA) RGB31.3B(BA)
N$357: RGB31.6(GC) RGB31.6A(GC) RGB31.6B(GC) RGB32.1(GA) RGB32.1A(GA) RGB32.1B(GA)
N$358: RGB31.5(RC) RGB31.5A(RC) RGB31.5B(RC) RGB32.2(RA) RGB32.2A(RA) RGB32.2B(RA)
N$359: RGB31.4(BC) RGB31.4A(BC) RGB31.4B(BC) RGB32.3(BA) RGB32.3A(BA) RGB32.3B(BA)
N$360: RGB24.1(GA) RGB24.1A(GA) RGB24.1B(GA) RGB32.6(GC) RGB32.6A(GC) RGB32.6B(GC)
N$361: RGB24.2(RA) RGB24.2A(RA) RGB24.2B(RA) RGB32.5(RC) RGB32.5A(RC) RGB32.5B(RC)
N$362: RGB24.3(BA) RGB24.3A(BA) RGB24.3B(BA) RGB32.4(BC) RGB32.4A(BC) RGB32.4B(BC)
N$363: RGB23.1(GA) RGB23.1A(GA) RGB23.1B(GA) RGB24.6(GC) RGB24.6A(GC) RGB24.6B(GC)
N$364: RGB23.2(RA) RGB23.2A(RA) RGB23.2B(RA) RGB24.5(RC) RGB24.5A(RC) RGB24.5B(RC)
N$365: RGB23.3(BA) RGB23.3A(BA) RGB23.3B(BA) RGB24.4(BC) RGB24.4A(BC) RGB24.4B(BC)
N$366: RGB22.1(GA) RGB22.1A(GA) RGB22.1B(GA) RGB23.6(GC) RGB23.6A(GC) RGB23.6B(GC)
N$367: RGB22.2(RA) RGB22.2A(RA) RGB22.2B(RA) RGB23.5(RC) RGB23.5A(RC) RGB23.5B(RC)
N$368: RGB22.3(BA) RGB22.3A(BA) RGB22.3B(BA) RGB23.4(BC) RGB23.4A(BC) RGB23.4B(BC)
N$369: RGB21.1(GA) RGB21.1A(GA) RGB21.1B(GA) RGB22.6(GC) RGB22.6A(GC) RGB22.6B(GC)
N$370: RGB21.2(RA) RGB21.2A(RA) RGB21.2B(RA) RGB22.5(RC) RGB22.5A(RC) RGB22.5B(RC)
N$371: RGB21.3(BA) RGB21.3A(BA) RGB21.3B(BA) RGB22.4(BC) RGB22.4A(BC) RGB22.4B(BC)
N$372: Q6.2(B1) Q6.4(B2) U3.1(OUT)
N$374: Q6.1(E1) R12.2
N$375: Q5.1(E1) R10.2
N$378: Q3.1(E1) R2.2
Q7A: Q6.7(C1) Q6.8(C1) Q6.8A(C1) Q6.8B(C1) Q6.8C1(C1) Q6.8C2(C1) Q6.8C3(C1) Q6.8C(C1) Q6.78(C1) Q6.78A(C1) Q6.78B(C1) RGB21.6(GC) RGB21.6A(GC) RGB21.6B(GC)
Q7B: Q6.5(C2) Q6.5A1(C2) Q6.5A(C2) Q6.5B(C2) Q6.5C1(C2) Q6.5C2(C2) Q6.5C(C2) Q6.6(C2) Q6.56(C2) Q6.56A(C2) Q6.56B(C2) RGB5.6(GC) RGB5.6A(GC) RGB5.6B(GC)
Q8A: Q5.7(C1) Q5.8(C1) Q5.8A(C1) Q5.8B(C1) Q5.8C1(C1) Q5.8C2(C1) Q5.8C3(C1) Q5.8C(C1) Q5.78(C1) Q5.78A(C1) Q5.78B(C1) RGB21.5(RC) RGB21.5A(RC) RGB21.5B(RC)
Q8B: Q5.5(C2) Q5.5A1(C2) Q5.5A(C2) Q5.5B(C2) Q5.5C1(C2) Q5.5C2(C2) Q5.5C(C2) Q5.6(C2) Q5.56(C2) Q5.56A(C2) Q5.56B(C2) RGB5.5(RC) RGB5.5A(RC) RGB5.5B(RC)
Q9A: Q3.7(C1) Q3.8(C1) Q3.8A(C1) Q3.8B(C1) Q3.8C1(C1) Q3.8C2(C1) Q3.8C3(C1) Q3.8C(C1) Q3.78(C1) Q3.78A(C1) Q3.78B(C1) RGB21.4(BC) RGB21.4A(BC) RGB21.4B(BC)
Q9B: Q3.5(C2) Q3.5A1(C2) Q3.5A(C2) Q3.5B(C2) Q3.5C1(C2) Q3.5C2(C2) Q3.5C(C2) Q3.6(C2) Q3.56(C2) Q3.56A(C2) Q3.56B(C2) RGB5.4(BC) RGB5.4A(BC) RGB5.4B(BC)
RED_UR: U6.3(IN+) U8.4(VO_C)
SCLK: U8.7(SCLK) ; also sheet 1,3,6
UR_EN: U8.6(!SYNC) ; also sheet 1
V_IR: C11.1 D2.K R20.2 U10.4(VIN) ; also sheet 1,3,6
V_RGB: C1.1 C2.1 C12.1 R14.2 R18.2 R19.2 RGB13.1(GA) RGB13.1A(GA) RGB13.1B(GA) RGB13.2(RA) RGB13.2A(RA) RGB13.2B(RA) RGB13.3(BA) RGB13.3A(BA) RGB13.3B(BA) RGB29.1(GA) RGB29.1A(GA) RGB29.1B(GA) RGB29.2(RA) RGB29.2A(RA) RGB29.2B(RA) RGB29.3(BA) RGB29.3A(BA) RGB29.3B(BA) ; also sheet 1,3,6
Unconnected: U10.3(N/C)

### Notes on the sheet
- UR

## Sheet 5 of 6